# EasyEDA Pro project Kerbal Controller.eprj, board PCB1
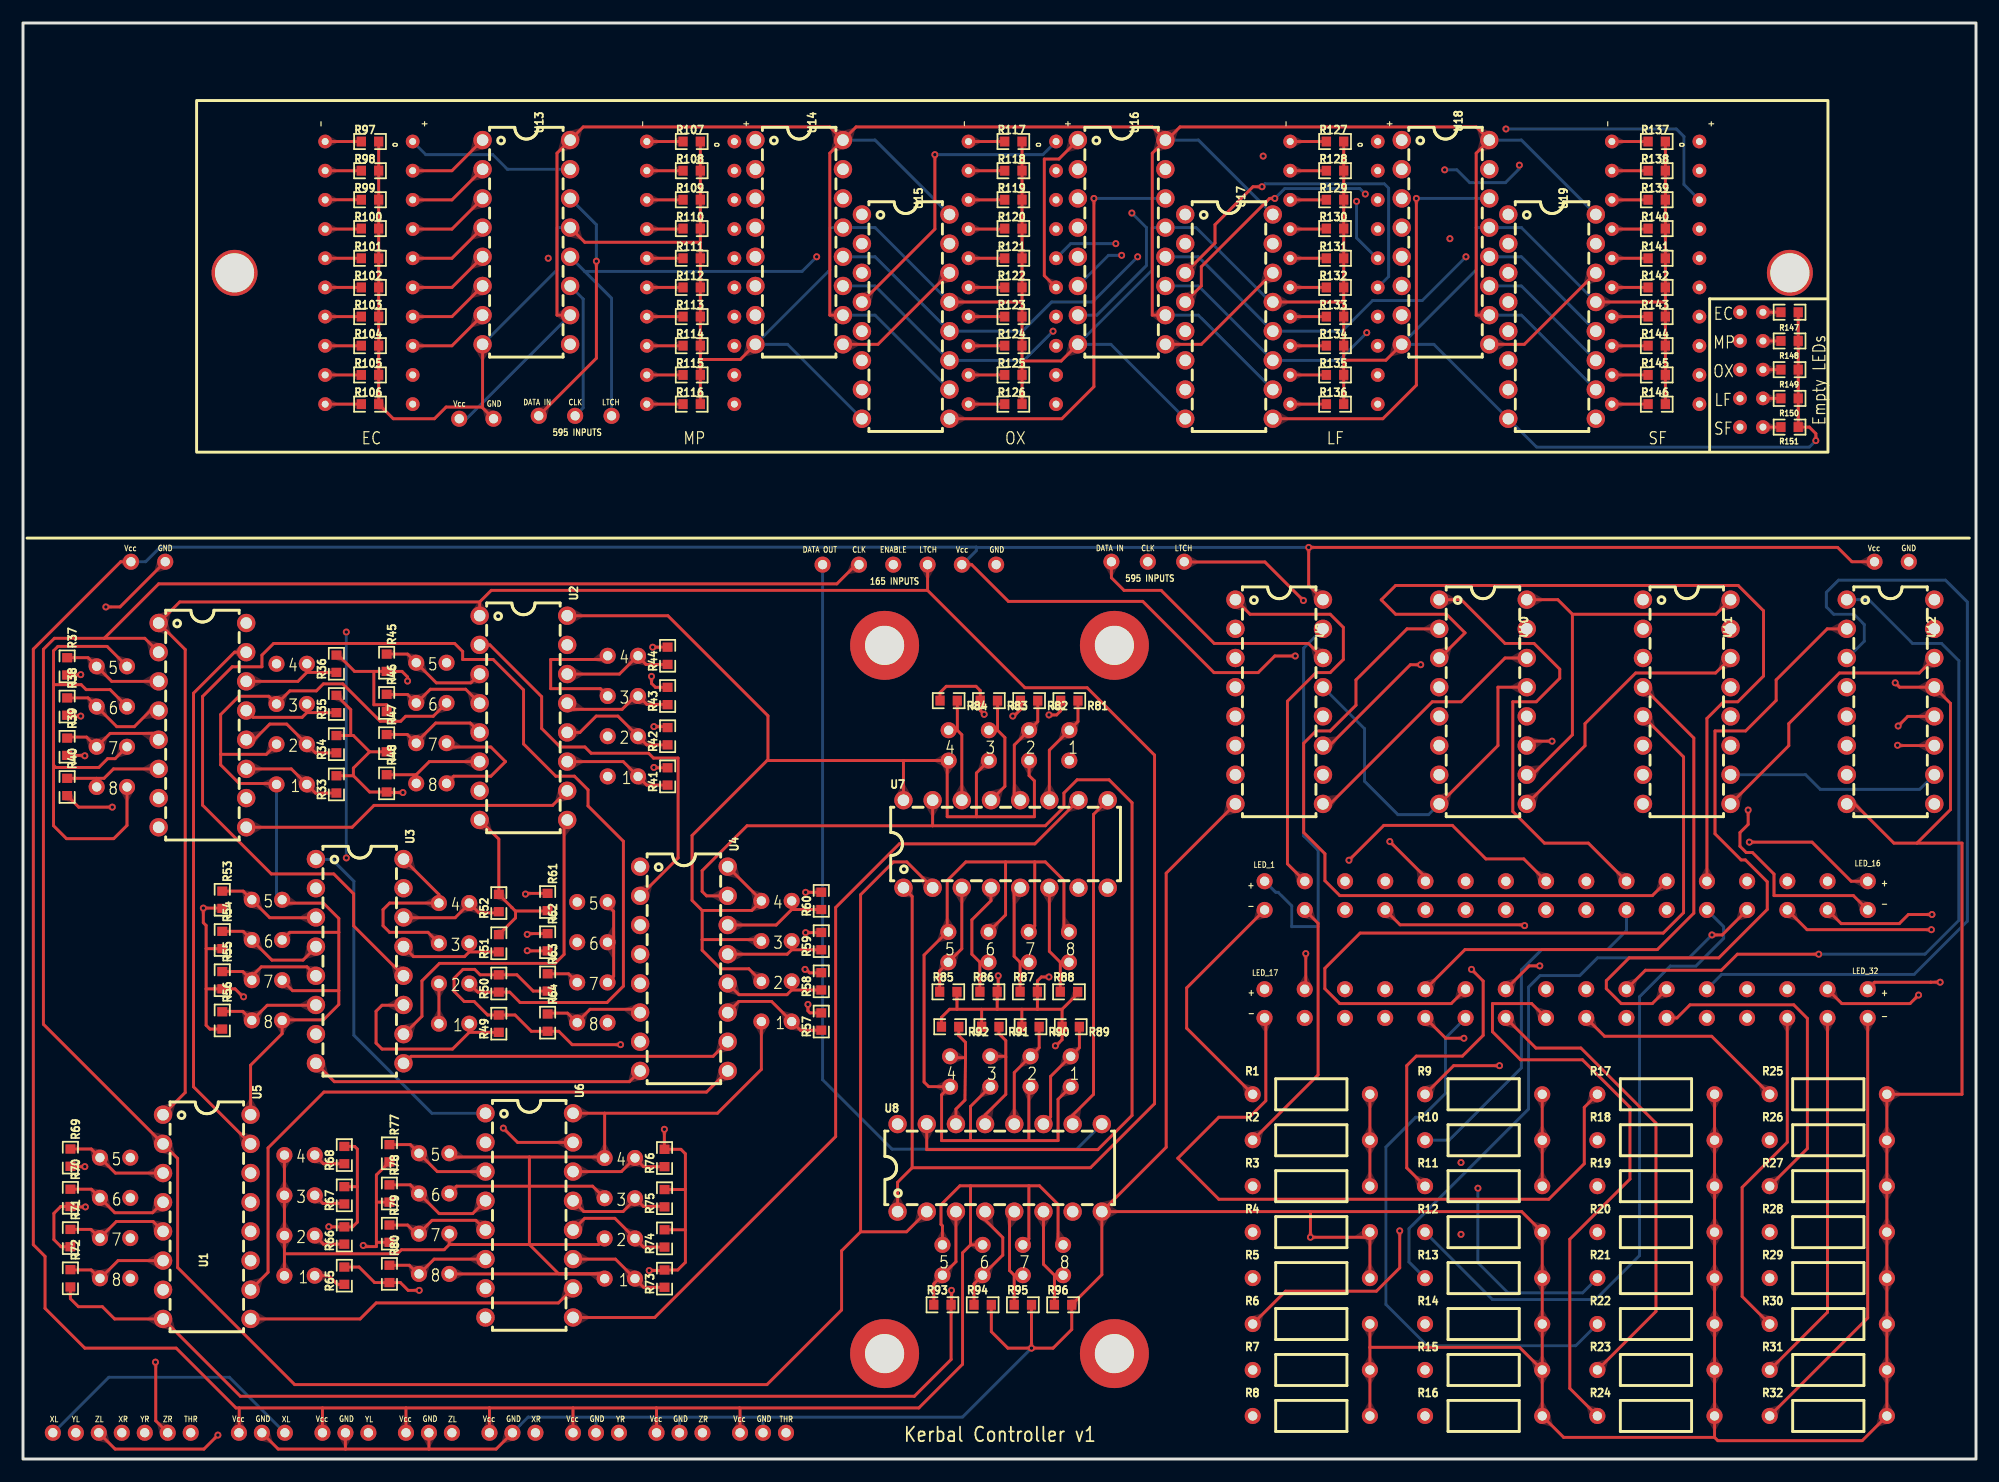
[diagram p1: board, top side]
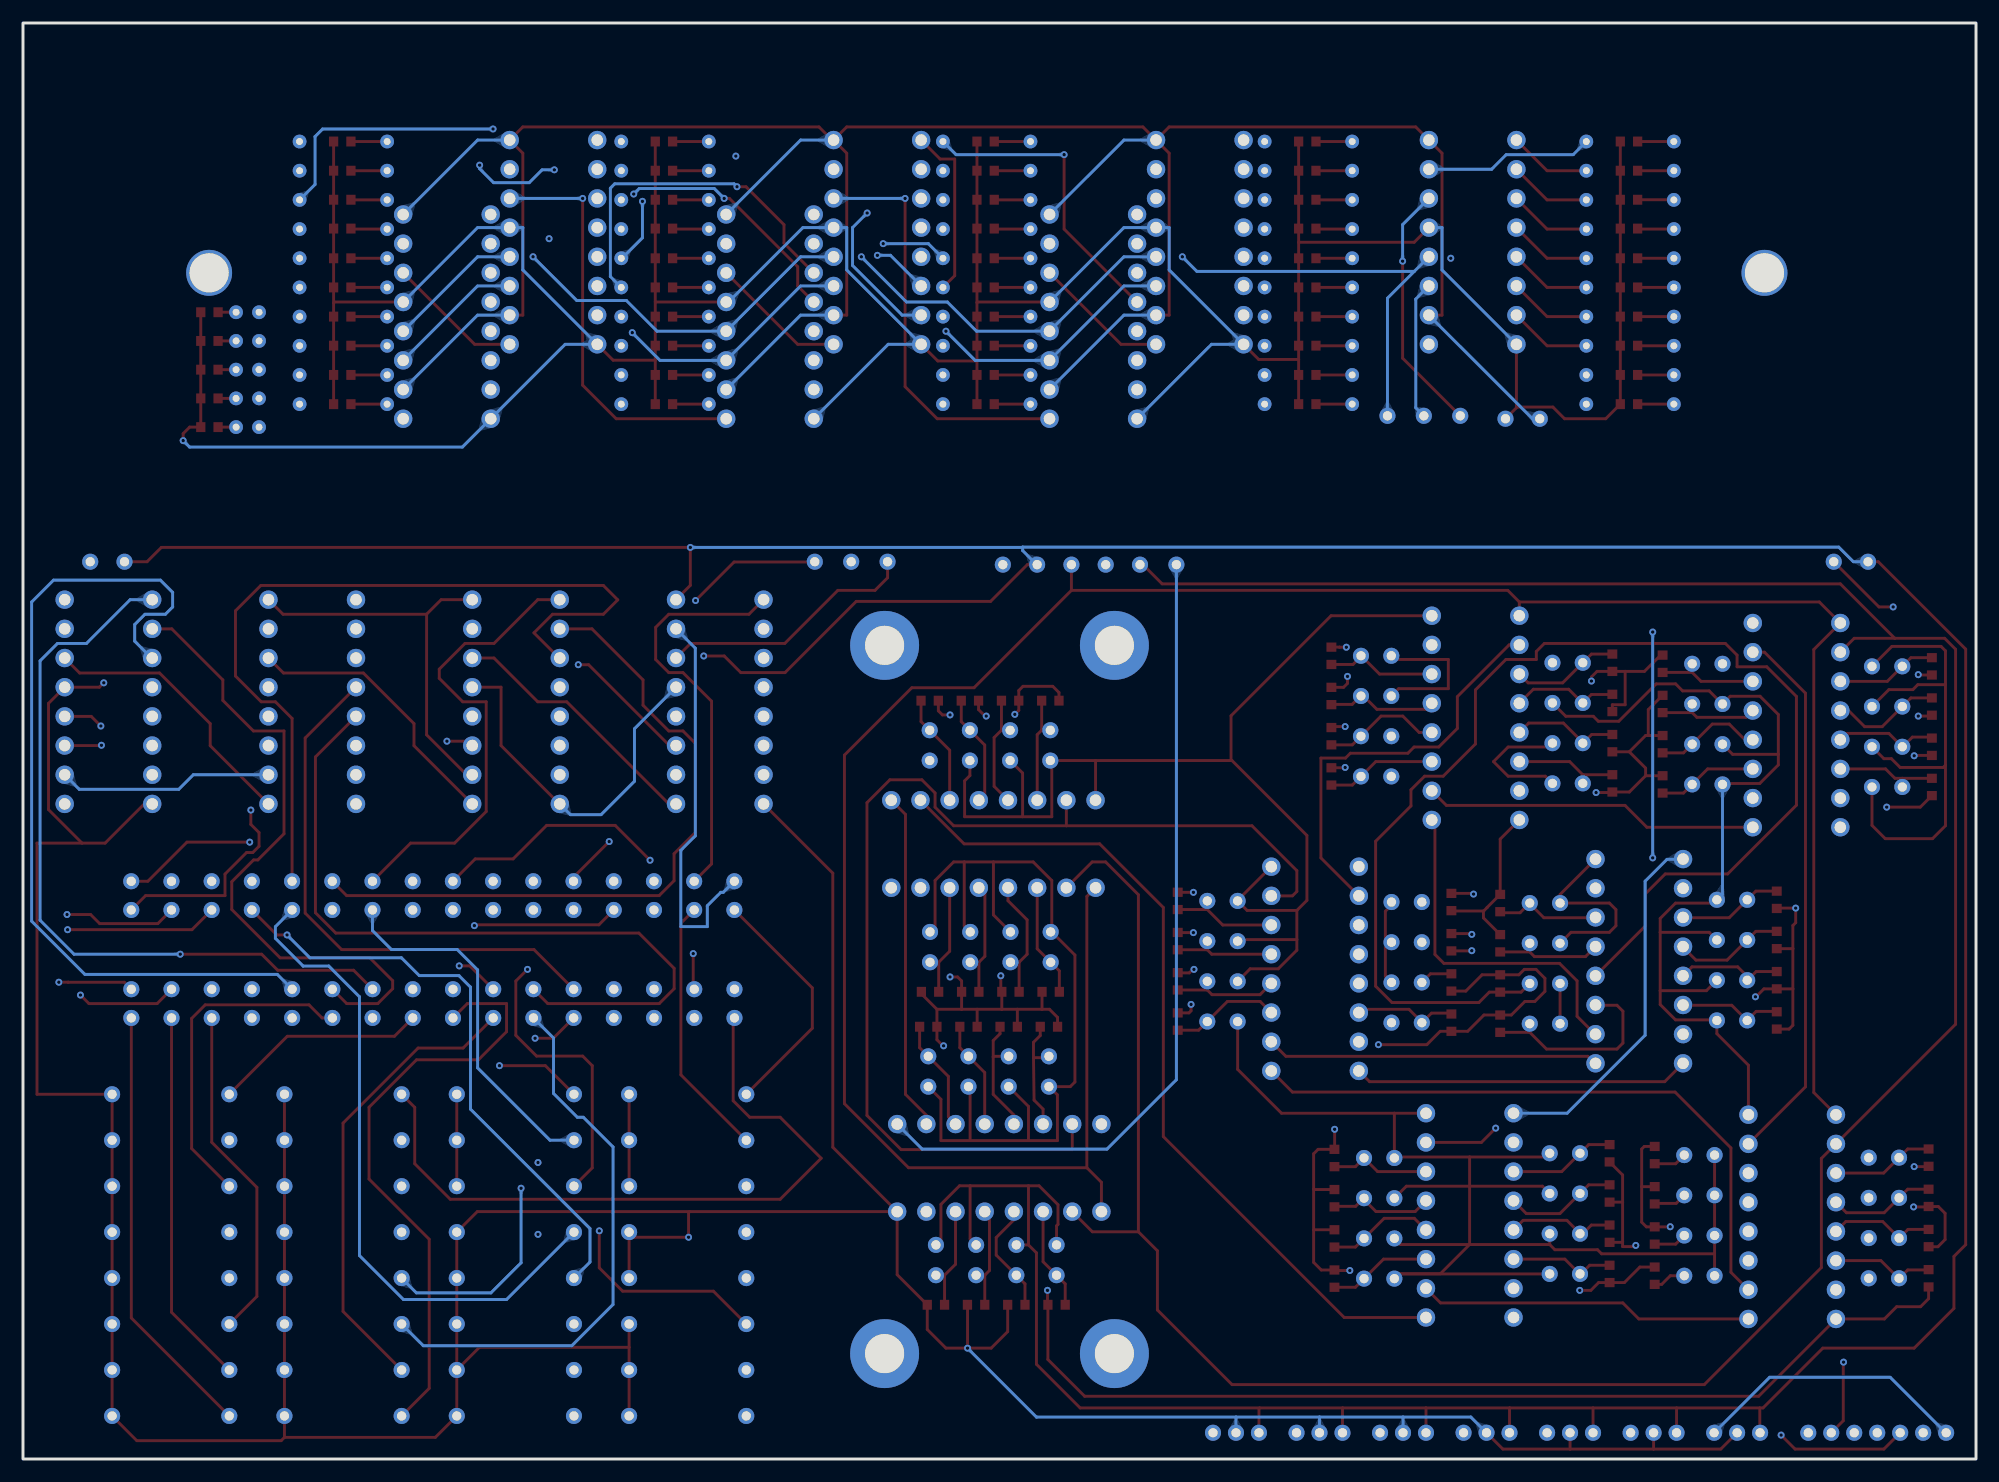
[diagram p2: board, bottom side, seen from below]

Outline 170 x 125 mm; copper layers: Top Layer, Inner1, Inner2, Bottom Layer. Coordinates in mm from the lower left corner of the outline.
Outline path: rectangle 0,125 170,0
Stack: Top Layer 0.035mm / Dielectric1 0.48mm PP er 4.5 / Inner1 0.035mm / Dielectric2 0.48mm FR4 er 4.5 / Inner2 0.035mm / Dielectric3 0.48mm PP er 4.5 / Bottom Layer 0.035mm

## Design rules (mm)
spacing safeClearance (default): track to track 0.152, other pairs 0.152 to 0.3
track width trackWidth (default): min 0.127, default 0.254, max 2.54
differential pair differentialPair (default): width min 0.127, default 0.254, max 2.54; gap min 0.152, default 0.152
via viaSize (default): diameter min 0.5, default 0.61, max 10; hole min 0.3, default 0.305, max 6

## Placement (name value [footprint] x y rotation side)
NOREF  -  [Pad_e11020]  48.24 37.98 270 top
NOREF#2  -  [Pad_e10925]  22.76 26.46 90 top
NOREF#3  -  [Pad_e7377]  82.3 101.98 0 top
NOREF#4  -  [Pad_e9050]  139.58 47.79 0 top
NOREF#5  -  [Pad_e7418]  145.92 112.14 0 top
NOREF#6  -  [Pad_e10947]  22.56 41.68 270 top
NOREF#7  -  [Pad_e10944]  84.05 43.24 0 top
NOREF#8  -  [Pad_e9063]  108.07 40.89 0 top
NOREF#9  -  [Pad_e7408]  110.3 94.36 0 top
NOREF#10  -  [Pad_e10998]  34.47 26.61 270 top
NOREF#11  -  [Pad_e94]  72.77 77.85 90 top
NOREF#12  -  [Pad_e9062]  160.58 47.79 0 top
NOREF#13  -  [Pad_e9038]  118.58 47.79 0 top
NOREF#14  -  [Pad_e149]  30.07 2.29 0 top
NOREF#15  -  [Pad_e9075]  129.07 40.89 0 top
NOREF#16  -  [Pad_e9032]  108.08 47.79 0 top
NOREF#17  -  [Pad_e7396]  117.92 112.14 0 top
NOREF#18  -  [Pad_e10990]  53.27 26.2 90 top
NOREF#19  -  [Pad_e10902]  25.4 15.96 90 top
NOREF#20  -  [Pad_e10938]  6.42 65.5 270 top
NOREF#21  -  [Pad_e10899]  36.21 37.89 90 top
NOREF#22  -  [Pad_e10963]  64.27 38.08 90 top
NOREF#23  -  [Pad_e174]  55.15 2.29 0 top
NOREF#24  -  [Pad_e100]  81.72 77.85 90 top
NOREF#25  -  [Pad_e187]  14.6 2.29 0 top
NOREF#26  -  [Pad_e7331]  54.3 94.36 0 top
NOREF#27  -  [Pad_e10958]  6.7 15.73 270 top
NOREF#28  -  [Pad_e7318]  33.92 99.44 0 top
NOREF#29  -  [Pad_e10975]  87.7 32.41 180 top
NOREF#30  -  [Pad_e8383]  75 9.18 0 top
NOREF#31  -  [Pad_e10914]  24.71 65.72 90 top
NOREF#32  -  [Pad_e151]  35.34 2.29 0 top
NOREF#33  -  [Pad_e10980]  66.91 45.08 90 top
NOREF#34  -  [Pad_e183]  6.6 2.29 0 top
NOREF#35  -  [Pad_e9048]  136.08 47.79 0 top
NOREF#36  -  [Pad_e7401]  110.3 104.52 0 top
NOREF#37  -  [Pad_e7414]  145.92 109.6 0 top
NOREF#38  -  [Pad_e9088]  150.07 38.39 0 top
NOREF#39  -  [Pad_e9039]  122.08 50.29 0 top
NOREF#40  -  [Pad_e7321]  26.3 94.36 0 top
NOREF#41  -  [Pad_e10995]  50.88 48.48 270 top
NOREF#42  -  [Pad_e11002]  34.23 65.81 270 top
NOREF#43  -  [Pad_e10936]  80.55 43.24 0 top
NOREF#44  -  [Pad_e9037]  118.58 50.29 0 top
NOREF#45  -  [Pad_e9089]  153.57 40.89 0 top
NOREF#46  -  [Pad_e10921]  22.07 69.22 90 top
NOREF#47  -  [Pad_e96]  75.76 77.85 90 top
NOREF#48  -  [Pad_e9509]  149.45 92.32 0 top
NOREF#49  -  [Pad_e10959]  91.05 45.88 0 top
NOREF#50  -  [Pad_e178]  64.42 2.29 0 top
NOREF#51  -  [Pad_e7381]  89.92 99.44 0 top
NOREF#52  -  [Pad_e9061]  160.58 50.29 0 top
NOREF#53  -  [Pad_e9042]  125.58 47.79 0 top
NOREF#54  -  [Pad_e7374]  89.92 112.14 0 top
NOREF#55  -  [Pad_e10924]  38.84 48.39 90 top
NOREF#56  -  [Pad_e7372]  89.92 107.06 0 top
NOREF#57  -  [Pad_e10993]  36.87 69.31 270 top
NOREF#58  -  [Pad_e7257]  33.92 107.06 0 top
NOREF#59  -  [Pad_e7393]  110.3 107.06 0 top
NOREF#60  -  [Pad_e7268]  61.92 109.6 0 top
NOREF#61  -  [Pad_e9043]  129.08 50.29 0 top
NOREF#62  -  [Pad_e9510]  151.45 92.32 0 top
NOREF#63  -  [Pad_e9055]  150.08 50.29 0 top
NOREF#64  -  [Pad_e7398]  117.92 114.68 0 top
NOREF#65  -  [Pad_e9081]  139.57 40.89 0 top
NOREF#66  -  [Pad_e7254]  26.3 109.6 0 top
NOREF#67  -  [Pad_e11011]  50.88 41.48 270 top
NOREF#68  -  [Pad_e11026]  90.53 16 0 top
NOREF#69  -  [Pad_e7322]  33.92 94.36 0 top
NOREF#70  -  [Pad_e98]  78.74 77.85 90 top
NOREF#71  -  [Pad_e154]  42.61 2.29 0 top
NOREF#72  -  [Pad_e10988]  66.91 48.58 90 top
NOREF#73  -  [Pad_e10932]  19.92 48.68 270 top
NOREF#74  -  [Pad_e9059]  157.08 50.29 0 top
NOREF#75  -  [Pad_e10918]  25.4 22.96 90 top
NOREF#76  -  [Pad_e9078]  132.57 38.39 0 top
NOREF#77  -  [Pad_e7416]  145.92 107.06 0 top
NOREF#78  -  [Pad_e181]  2.6 2.29 0 top
NOREF#79  -  [Pad_e10952]  87.55 43.24 0 top
NOREF#80  -  [Pad_e7333]  54.3 91.82 0 top
NOREF#81  -  [Pad_e9057]  153.58 50.29 0 top
NOREF#82  -  [Pad_e144]  18.8 2.29 0 top
NOREF#83  -  [Pad_e7269]  54.3 107.06 0 top
NOREF#84  -  [Pad_e10989]  50.63 26.2 90 top
NOREF#85  -  [Pad_e10971]  64.27 41.58 90 top
NOREF#86  -  [Pad_e10999]  80.03 18.64 0 top
NOREF#87  -  [Pad_e7313]  18.42 103.25 0 top
NOREF#88  -  [Pad_e9094]  160.57 38.39 0 top
NOREF#89  -  [Pad_e7402]  117.92 104.52 0 top
NOREF#90  -  [Pad_e7330]  61.92 96.9 0 top
NOREF#91  -  [Pad_e9064]  108.07 38.39 0 top
NOREF#92  -  [Pad_e7425]  145.92 99.44 0 top
NOREF#93  -  [Pad_e10911]  87.58 60.8 180 top
NOREF#94  -  [Pad_e7421]  138.3 101.98 0 top
NOREF#95  -  [Pad_e7378]  89.92 101.98 0 top
NOREF#96  -  [Pad_e7465]  44.89 90.81 0 top
NOREF#97  -  [Pad_e10926]  25.4 26.46 90 top
NOREF#98  -  [Pad_e102]  84.71 77.85 90 top
NOREF#99  -  [Pad_e9087]  150.07 40.89 0 top
NOREF#100  -  [Pad_e10961]  50.9 59.42 90 top
NOREF#101  -  [Pad_e11003]  50.88 44.98 270 top
NOREF#102  -  [Pad_e10978]  53.54 66.42 90 top
NOREF#103  -  [Pad_e10910]  25.4 19.46 90 top
NOREF#104  -  [Pad_e10905]  22.07 62.22 90 top
NOREF#105  -  [Pad_e10973]  50.63 19.2 90 top
NOREF#106  -  [Pad_e9507]  149.45 94.82 0 top
NOREF#107  -  [Pad_e9041]  125.58 50.29 0 top
NOREF#108  -  [Pad_e9068]  115.07 38.39 0 top
NOREF#109  -  [Pad_e7256]  26.3 107.06 0 top
NOREF#110  -  [Pad_e7251]  33.92 114.68 0 top
NOREF#111  -  [Pad_e9086]  146.57 38.39 0 top
NOREF#112  -  [Pad_e10908]  38.84 41.39 90 top
NOREF#113  -  [Pad_e10917]  22.76 22.96 90 top
NOREF#114  -  [Pad_e7270]  61.92 107.06 0 top
NOREF#115  -  [Pad_e9049]  139.58 50.29 0 top
NOREF#116  -  [Pad_e7391]  110.3 109.6 0 top
NOREF#117  -  [Pad_e16678]  9.4 78.11 90 top
NOREF#118  -  [Pad_e10949]  9.34 19.23 270 top
NOREF#119  -  [Pad_e176]  59.15 2.29 0 top
NOREF#120  -  [Pad_e10984]  84.2 35.05 180 top
NOREF#121  -  [Pad_e184]  8.6 2.29 0 top
NOREF#122  -  [Pad_e10977]  50.9 66.42 90 top
NOREF#123  -  [Pad_e7380]  89.92 104.52 0 top
NOREF#124  -  [Pad_e157]  49.88 2.29 0 top
NOREF#125  -  [Pad_e10962]  53.54 59.42 90 top
NOREF#126  -  [Pad_e9074]  125.57 38.39 0 top
NOREF#127  -  [Pad_e11007]  83.53 18.64 0 top
NOREF#128  -  [Pad_e16676]  161.16 78.11 90 top
NOREF#129  -  [Pad_e10983]  84.2 32.41 180 top
NOREF#130  -  [Pad_e9071]  122.07 40.89 0 top
NOREF#131  -  [Pad_e9085]  146.57 40.89 0 top
NOREF#132  -  [Pad_e9504]  151.45 99.82 0 top
NOREF#133  -  [Pad_e7255]  33.92 109.6 0 top
NOREF#134  -  [Pad_e11021]  37.11 16.11 270 top
NOREF#135  -  [Pad_e10964]  66.91 38.08 90 top
NOREF#136  -  [Pad_e10965]  50.63 15.7 90 top
NOREF#137  -  [Pad_e9092]  157.07 38.39 0 top
NOREF#138  -  [Pad_e10954]  6.42 58.5 270 top
NOREF#139  -  [Pad_e9054]  146.58 47.79 0 top
NOREF#140  -  [Pad_e9056]  150.08 47.79 0 top
NOREF#141  -  [Pad_e10900]  38.84 37.89 90 top
NOREF#142  -  [Pad_e7406]  110.3 96.9 0 top
NOREF#143  -  [Pad_e10903]  91.08 60.8 180 top
NOREF#144  -  [Pad_e11005]  37.11 23.11 270 top
NOREF#145  -  [Pad_e7196]  94.74 78.11 0 top
NOREF#146  -  [Pad_e7258]  26.3 104.52 0 top
NOREF#147  -  [Pad_e7264]  61.92 114.68 0 top
NOREF#148  -  [Pad_e11014]  34.47 19.61 270 top
NOREF#149  -  [Pad_e10970]  53.54 62.92 90 top
NOREF#150  -  [Pad_e7197]  97.91 78.11 0 top
NOREF#151  -  [Pad_e16675]  164.15 78.11 90 top
NOREF#152  -  [Pad_e10986]  53.54 69.92 90 top
NOREF#153  -  [Pad_e10940]  19.92 45.18 270 top
NOREF#154  -  [Pad_e9036]  115.08 47.79 0 top
NOREF#155  -  [Pad_e9084]  143.07 38.39 0 top
NOREF#156  -  [Pad_e9511]  149.45 89.82 0 top
NOREF#157  -  [Pad_e7407]  117.92 96.9 0 top
NOREF#158  -  [Pad_e11013]  37.11 19.61 270 top
NOREF#159  -  [Pad_e179]  66.42 2.29 0 top
NOREF#160  -  [Pad_e7385]  89.92 96.9 0 top
NOREF#161  -  [Pad_e9067]  115.07 40.89 0 top
NOREF#162  -  [Pad_e9505]  149.45 97.32 0 top
NOREF#163  -  [Pad_e10992]  80.7 35.05 180 top
NOREF#164  -  [Pad_e7387]  89.92 94.36 0 top
NOREF#165  -  [Pad_e10950]  6.7 19.23 270 top
NOREF#166  -  [Pad_e7420]  145.92 114.68 0 top
NOREF#167  -  [Pad_e9091]  157.07 40.89 0 top
NOREF#168  -  [Pad_e7327]  54.3 99.44 0 top
NOREF#169  -  [Pad_e10997]  37.11 26.61 270 top
NOREF#170  -  [Pad_e10991]  80.7 32.41 180 top
NOREF#171  -  [Pad_e7267]  54.3 109.6 0 top
NOREF#172  -  [Pad_e10974]  53.27 19.2 90 top
NOREF#173  -  [Pad_e7326]  61.92 101.98 0 top
NOREF#174  -  [Pad_e10920]  84.08 63.44 180 top
NOREF#175  -  [Pad_e11016]  87.03 16 0 top
NOREF#176  -  [Pad_e145]  20.8 2.29 0 top
NOREF#177  -  [Pad_e10953]  9.06 58.5 270 top
NOREF#178  -  [Pad_e10943]  84.05 45.88 0 top
NOREF#179  -  [Pad_e9090]  153.57 38.39 0 top
NOREF#180  -  [Pad_e10960]  91.05 43.24 0 top
NOREF#181  -  [Pad_e7329]  54.3 96.9 0 top
NOREF#182  -  [Pad_e7373]  82.3 112.14 0 top
NOREF#183  -  [Pad_e10933]  9.34 26.23 270 top
NOREF#184  -  [Pad_e9077]  132.57 40.89 0 top
NOREF#185  -  [Pad_e7426]  138.3 91.82 0 top
NOREF#186  -  [Pad_e10968]  91.2 35.05 180 top
NOREF#187  -  [Pad_e7417]  138.3 112.14 0 top
NOREF#188  -  [Pad_e10951]  87.55 45.88 0 top
NOREF#189  -  [Pad_e8382]  95 70.83 0 top
NOREF#190  -  [Pad_e10909]  22.76 19.46 90 top
NOREF#191  -  [Pad_e11010]  34.23 62.31 270 top
NOREF#192  -  [Pad_e152]  37.34 2.29 0 top
NOREF#193  -  [Pad_e10937]  9.06 65.5 270 top
NOREF#194  -  [Pad_e10969]  50.9 62.92 90 top
NOREF#195  -  [Pad_e10907]  36.21 41.39 90 top
NOREF#196  -  [Pad_e7319]  26.3 96.9 0 top
NOREF#197  -  [Pad_e10929]  9.06 69 270 top
NOREF#198  -  [Pad_e10930]  6.42 69 270 top
NOREF#199  -  [Pad_e7328]  61.92 99.44 0 top
NOREF#200  -  [Pad_e10931]  22.56 48.68 270 top
NOREF#201  -  [Pad_e10912]  87.58 63.44 180 top
NOREF#202  -  [Pad_e7314]  153.8 103.25 0 top
NOREF#203  -  [Pad_e7415]  138.3 107.06 0 top
NOREF#204  -  [Pad_e9503]  149.45 99.82 0 top
NOREF#205  -  [Pad_e7409]  117.92 94.36 0 top
NOREF#206  -  [Pad_e9053]  146.58 50.29 0 top
NOREF#207  -  [Pad_e11015]  87.03 18.64 0 top
NOREF#208  -  [Pad_e7397]  110.3 114.68 0 top
NOREF#209  -  [Pad_e9069]  118.57 40.89 0 top
NOREF#210  -  [Pad_e7424]  145.92 104.52 0 top
NOREF#211  -  [Pad_e9045]  132.58 50.29 0 top
NOREF#212  -  [Pad_e10946]  6.42 62 270 top
NOREF#213  -  [Pad_e7423]  138.3 104.52 0 top
NOREF#214  -  [Pad_e10981]  50.63 22.7 90 top
NOREF#215  -  [Pad_e9512]  151.45 89.82 0 top
NOREF#216  -  [Pad_e147]  26.07 2.29 0 top
NOREF#217  -  [Pad_e9066]  111.57 38.39 0 top
NOREF#218  -  [Pad_e175]  57.15 2.29 0 top
NOREF#219  -  [Pad_e11025]  90.53 18.64 0 top
NOREF#220  -  [Pad_e7413]  138.3 109.6 0 top
NOREF#221  -  [Pad_e56]  69.6 77.85 0 top
NOREF#222  -  [Pad_e177]  62.42 2.29 0 top
NOREF#223  -  [Pad_e7324]  33.92 91.82 0 top
NOREF#224  -  [Pad_e9040]  122.08 47.79 0 top
NOREF#225  -  [Pad_e7332]  61.92 94.36 0 top
NOREF#226  -  [Pad_e158]  51.88 2.29 0 top
NOREF#227  -  [Pad_e7419]  138.3 114.68 0 top
NOREF#228  -  [Pad_e10913]  22.07 65.72 90 top
NOREF#229  -  [Pad_e11019]  50.88 37.98 270 top
NOREF#230  -  [Pad_e150]  33.34 2.29 0 top
NOREF#231  -  [Pad_e155]  44.61 2.29 0 top
NOREF#232  -  [Pad_e8380]  75 70.83 0 top
NOREF#233  -  [Pad_e9072]  122.07 38.39 0 top
NOREF#234  -  [Pad_e9060]  157.08 47.79 0 top
NOREF#235  -  [Pad_e11009]  36.87 62.31 270 top
NOREF#236  -  [Pad_e9035]  115.08 50.29 0 top
NOREF#237  -  [Pad_e7263]  54.3 114.68 0 top
NOREF#238  -  [Pad_e7469]  37.97 90.55 90 top
NOREF#239  -  [Pad_e10904]  91.08 63.44 180 top
NOREF#240  -  [Pad_e7265]  54.3 112.14 0 top
NOREF#241  -  [Pad_e11022]  34.47 16.11 270 top
NOREF#242  -  [Pad_e9070]  118.57 38.39 0 top
NOREF#243  -  [Pad_e10934]  6.7 26.23 270 top
NOREF#244  -  [Pad_e186]  12.6 2.29 0 top
NOREF#245  -  [Pad_e10935]  80.55 45.88 0 top
NOREF#246  -  [Pad_e11008]  83.53 16 0 top
NOREF#247  -  [Pad_e7429]  145.92 96.9 0 top
NOREF#248  -  [Pad_e7463]  51.23 90.81 0 top
NOREF#249  -  [Pad_e7334]  61.92 91.82 0 top
NOREF#250  -  [Pad_e9033]  111.58 50.29 0 top
NOREF#251  -  [Pad_e7432]  145.92 91.82 0 top
NOREF#252  -  [Pad_e7388]  89.92 91.82 0 top
NOREF#253  -  [Pad_e7370]  89.92 109.6 0 top
NOREF#254  -  [Pad_e9034]  111.58 47.79 0 top
NOREF#255  -  [Pad_e7261]  33.92 104.52 0 top
NOREF#256  -  [Pad_e10957]  9.34 15.73 270 top
NOREF#257  -  [Pad_e10956]  19.92 38.18 270 top
NOREF#258  -  [Pad_e7430]  138.3 94.36 0 top
NOREF#259  -  [Pad_e16677]  12.38 78.11 90 top
NOREF#260  -  [Pad_e10927]  80.58 60.8 180 top
NOREF#261  -  [Pad_e10955]  22.56 38.18 270 top
NOREF#262  -  [Pad_e10942]  6.7 22.73 270 top
NOREF#263  -  [Pad_e7383]  82.3 99.44 0 top
NOREF#264  -  [Pad_e7399]  110.3 101.98 0 top
NOREF#265  -  [Pad_e7272]  61.92 104.52 0 top
NOREF#266  -  [Pad_e11018]  34.23 58.81 270 top
NOREF#267  -  [Pad_e9083]  143.07 40.89 0 top
NOREF#268  -  [Pad_e10976]  87.7 35.05 180 top
NOREF#269  -  [Pad_e11004]  48.24 44.98 270 top
NOREF#270  -  [Pad_e7395]  110.3 112.14 0 top
NOREF#271  -  [Pad_e10967]  91.2 32.41 180 top
NOREF#272  -  [Pad_e10898]  24.71 58.72 90 top
NOREF#273  -  [Pad_e7384]  82.3 96.9 0 top
NOREF#274  -  [Pad_e7369]  82.3 109.6 0 top
NOREF#275  -  [Pad_e7315]  26.3 101.98 0 top
NOREF#276  -  [Pad_e9506]  151.45 97.32 0 top
NOREF#277  -  [Pad_e7404]  110.3 91.82 0 top
NOREF#278  -  [Pad_e7410]  117.92 91.82 0 top
NOREF#279  -  [Pad_e10916]  38.84 44.89 90 top
NOREF#280  -  [Pad_e10915]  36.21 44.89 90 top
NOREF#281  -  [Pad_e10972]  66.91 41.58 90 top
NOREF#282  -  [Pad_e7375]  82.3 114.68 0 top
NOREF#283  -  [Pad_e7376]  89.92 114.68 0 top
NOREF#284  -  [Pad_e10987]  64.27 48.58 90 top
NOREF#285  -  [Pad_e10979]  64.27 45.08 90 top
NOREF#286  -  [Pad_e7271]  54.3 104.52 0 top
NOREF#287  -  [Pad_e146]  22.8 2.29 0 top
NOREF#288  -  [Pad_e182]  4.6 2.29 0 top
NOREF#289  -  [Pad_e10982]  53.27 22.7 90 top
NOREF#290  -  [Pad_e9076]  129.07 38.39 0 top
NOREF#291  -  [Pad_e10939]  22.56 45.18 270 top
NOREF#292  -  [Pad_e11006]  34.47 23.11 270 top
NOREF#293  -  [Pad_e7382]  82.3 91.82 0 top
NOREF#294  -  [Pad_e9073]  125.57 40.89 0 top
NOREF#295  -  [Pad_e9046]  132.58 47.79 0 top
NOREF#296  -  [Pad_e153]  40.61 2.29 0 top
NOREF#297  -  [Pad_e7320]  33.92 96.9 0 top
NOREF#298  -  [Pad_e9058]  153.58 47.79 0 top
NOREF#299  -  [Pad_e9082]  139.57 38.39 0 top
NOREF#300  -  [Pad_e10994]  34.23 69.31 270 top
NOREF#301  -  [Pad_e7392]  117.92 109.6 0 top
NOREF#302  -  [Pad_e9093]  160.57 40.89 0 top
NOREF#303  -  [Pad_e7394]  117.92 107.06 0 top
NOREF#304  -  [Pad_e11001]  36.87 65.81 270 top
NOREF#305  -  [Pad_e10922]  24.71 69.22 90 top
NOREF#306  -  [Pad_e9044]  129.08 47.79 0 top
NOREF#307  -  [Pad_e7371]  82.3 107.06 0 top
NOREF#308  -  [Pad_e7323]  26.3 91.82 0 top
NOREF#309  -  [Pad_e9080]  136.07 38.39 0 top
NOREF#310  -  [Pad_e7198]  101.08 78.11 0 top
NOREF#311  -  [Pad_e9047]  136.08 50.29 0 top
NOREF#312  -  [Pad_e7427]  138.3 99.44 0 top
NOREF#313  -  [Pad_e7253]  33.92 112.14 0 top
NOREF#314  -  [Pad_e7386]  82.3 94.36 0 top
NOREF#315  -  [Pad_e9031]  108.08 50.29 0 top
NOREF#316  -  [Pad_e10919]  84.08 60.8 180 top
NOREF#317  -  [Pad_e7422]  145.92 101.98 0 top
NOREF#318  -  [Pad_e7325]  54.3 101.98 0 top
NOREF#319  -  [Pad_e10985]  50.9 69.92 90 top
NOREF#320  -  [Pad_e7379]  82.3 104.52 0 top
NOREF#321  -  [Pad_e7428]  138.3 96.9 0 top
NOREF#322  -  [Pad_e8384]  95 9.18 0 top
NOREF#323  -  [Pad_e7317]  26.3 99.44 0 top
NOREF#324  -  [Pad_e10923]  36.21 48.39 90 top
NOREF#325  -  [Pad_e11012]  48.24 41.48 270 top
NOREF#326  -  [Pad_e10945]  9.06 62 270 top
NOREF#327  -  [Pad_e9065]  111.57 40.89 0 top
NOREF#328  -  [Pad_e10928]  80.58 63.44 180 top
NOREF#329  -  [Pad_e9051]  143.08 50.29 0 top
NOREF#330  -  [Pad_e7464]  48.06 90.81 0 top
NOREF#331  -  [Pad_e10966]  53.27 15.7 90 top
NOREF#332  -  [Pad_e7466]  40.96 90.55 90 top
NOREF#333  -  [Pad_e9079]  136.07 40.89 0 top
NOREF#334  -  [Pad_e148]  28.07 2.29 0 top
NOREF#335  -  [Pad_e7316]  33.92 101.98 0 top
NOREF#336  -  [Pad_e10941]  9.34 22.73 270 top
NOREF#337  -  [Pad_e7250]  26.3 114.68 0 top
NOREF#338  -  [Pad_e7431]  145.92 94.36 0 top
NOREF#339  -  [Pad_e185]  10.6 2.29 0 top
NOREF#340  -  [Pad_e9508]  151.45 94.82 0 top
NOREF#341  -  [Pad_e7266]  61.92 112.14 0 top
NOREF#342  -  [Pad_e10906]  24.71 62.22 90 top
NOREF#343  -  [Pad_e7400]  117.92 101.98 0 top
NOREF#344  -  [Pad_e7252]  26.3 112.14 0 top
NOREF#345  -  [Pad_e11017]  36.87 58.81 270 top
NOREF#346  -  [Pad_e7403]  117.92 99.44 0 top
NOREF#347  -  [Pad_e10901]  22.76 15.96 90 top
NOREF#348  -  [Pad_e10897]  22.07 58.72 90 top
NOREF#349  -  [Pad_e11000]  80.03 16 0 top
NOREF#350  -  [Pad_e9052]  143.08 47.79 0 top
NOREF#351  -  [Pad_e10996]  48.24 48.48 270 top
NOREF#352  -  [Pad_e156]  47.88 2.29 0 top
NOREF#353  -  [Pad_e7405]  110.3 99.44 0 top
NOREF#354  -  [Pad_e10948]  19.92 41.68 270 top
R1  220kΩ  [RES-TH_BD2.7-L6.2-P10.20-D0.4]  112.14 31.75 0 top
R2  220kΩ  [RES-TH_BD2.7-L6.2-P10.20-D0.4]  112.14 27.75 0 top
R3  220kΩ  [RES-TH_BD2.7-L6.2-P10.20-D0.4]  112.14 23.75 0 top
R4  220kΩ  [RES-TH_BD2.7-L6.2-P10.20-D0.4]  112.14 19.75 0 top
R5  220kΩ  [RES-TH_BD2.7-L6.2-P10.20-D0.4]  112.14 15.75 0 top
R6  220kΩ  [RES-TH_BD2.7-L6.2-P10.20-D0.4]  112.14 11.75 0 top
R7  220kΩ  [RES-TH_BD2.7-L6.2-P10.20-D0.4]  112.14 7.75 0 top
R8  220kΩ  [RES-TH_BD2.7-L6.2-P10.20-D0.4]  112.14 3.75 0 top
R9  220kΩ  [RES-TH_BD2.7-L6.2-P10.20-D0.4]  127.14 31.75 0 top
R10  220kΩ  [RES-TH_BD2.7-L6.2-P10.20-D0.4]  127.14 27.75 0 top
R11  220kΩ  [RES-TH_BD2.7-L6.2-P10.20-D0.4]  127.14 23.75 0 top
R12  220kΩ  [RES-TH_BD2.7-L6.2-P10.20-D0.4]  127.14 19.75 0 top
R13  220kΩ  [RES-TH_BD2.7-L6.2-P10.20-D0.4]  127.14 15.75 0 top
R14  220kΩ  [RES-TH_BD2.7-L6.2-P10.20-D0.4]  127.14 11.75 0 top
R15  220kΩ  [RES-TH_BD2.7-L6.2-P10.20-D0.4]  127.14 7.75 0 top
R16  220kΩ  [RES-TH_BD2.7-L6.2-P10.20-D0.4]  127.14 3.75 0 top
R17  220kΩ  [RES-TH_BD2.7-L6.2-P10.20-D0.4]  142.14 31.75 0 top
R18  220kΩ  [RES-TH_BD2.7-L6.2-P10.20-D0.4]  142.14 27.75 0 top
R19  220kΩ  [RES-TH_BD2.7-L6.2-P10.20-D0.4]  142.14 23.75 0 top
R20  220kΩ  [RES-TH_BD2.7-L6.2-P10.20-D0.4]  142.14 19.75 0 top
R21  220kΩ  [RES-TH_BD2.7-L6.2-P10.20-D0.4]  142.14 15.75 0 top
R22  220kΩ  [RES-TH_BD2.7-L6.2-P10.20-D0.4]  142.14 11.75 0 top
R23  220kΩ  [RES-TH_BD2.7-L6.2-P10.20-D0.4]  142.14 7.75 0 top
R24  220kΩ  [RES-TH_BD2.7-L6.2-P10.20-D0.4]  142.14 3.75 0 top
R25  220kΩ  [RES-TH_BD2.7-L6.2-P10.20-D0.4]  157.14 31.75 0 top
R26  220kΩ  [RES-TH_BD2.7-L6.2-P10.20-D0.4]  157.14 27.75 0 top
R27  220kΩ  [RES-TH_BD2.7-L6.2-P10.20-D0.4]  157.14 23.75 0 top
R28  220kΩ  [RES-TH_BD2.7-L6.2-P10.20-D0.4]  157.14 19.75 0 top
R29  220kΩ  [RES-TH_BD2.7-L6.2-P10.20-D0.4]  157.14 15.75 0 top
R30  220kΩ  [RES-TH_BD2.7-L6.2-P10.20-D0.4]  157.14 11.75 0 top
R31  220kΩ  [RES-TH_BD2.7-L6.2-P10.20-D0.4]  157.14 7.75 0 top
R32  220kΩ  [RES-TH_BD2.7-L6.2-P10.20-D0.4]  157.14 3.75 0 top
R33  10kΩ  [R0603]  27.28 58.72 90 top
R34  10kΩ  [R0603]  27.28 62.22 90 top
R35  10kΩ  [R0603]  27.28 65.72 90 top
R36  10kΩ  [R0603]  27.28 69.22 90 top
R37  10kΩ  [R0603]  3.84 69 270 top
R38  10kΩ  [R0603]  3.84 65.5 270 top
R39  10kΩ  [R0603]  3.84 62 270 top
R40  10kΩ  [R0603]  3.84 58.5 270 top
R41  10kΩ  [R0603]  56.11 59.42 90 top
R42  10kΩ  [R0603]  56.11 62.92 90 top
R43  10kΩ  [R0603]  56.11 66.42 90 top
R44  10kΩ  [R0603]  56.11 69.92 90 top
R45  10kΩ  [R0603]  31.66 69.31 270 top
R46  10kΩ  [R0603]  31.66 65.81 270 top
R47  10kΩ  [R0603]  31.66 62.31 270 top
R48  10kΩ  [R0603]  31.66 58.81 270 top
R49  10kΩ  [R0603]  41.42 37.89 90 top
R50  10kΩ  [R0603]  41.42 41.39 90 top
R51  10kΩ  [R0603]  41.42 44.89 90 top
R52  10kΩ  [R0603]  41.42 48.39 90 top
R53  10kΩ  [R0603]  17.34 48.68 270 top
R54  10kΩ  [R0603]  17.34 45.18 270 top
R55  10kΩ  [R0603]  17.34 41.68 270 top
R56  10kΩ  [R0603]  17.34 38.18 270 top
R57  10kΩ  [R0603]  69.49 38.08 90 top
R58  10kΩ  [R0603]  69.49 41.58 90 top
R59  10kΩ  [R0603]  69.49 45.08 90 top
R60  10kΩ  [R0603]  69.49 48.58 90 top
R61  10kΩ  [R0603]  45.67 48.48 270 top
R62  10kΩ  [R0603]  45.67 44.98 270 top
R63  10kΩ  [R0603]  45.67 41.48 270 top
R64  10kΩ  [R0603]  45.67 37.98 270 top
R65  10kΩ  [R0603]  27.97 15.96 90 top
R66  10kΩ  [R0603]  27.97 19.46 90 top
R67  10kΩ  [R0603]  27.97 22.96 90 top
R68  10kΩ  [R0603]  27.97 26.46 90 top
R69  10kΩ  [R0603]  4.13 26.23 270 top
R70  10kΩ  [R0603]  4.13 22.73 270 top
R71  10kΩ  [R0603]  4.13 19.23 270 top
R72  10kΩ  [R0603]  4.13 15.73 270 top
R73  10kΩ  [R0603]  55.84 15.7 90 top
R74  10kΩ  [R0603]  55.84 19.2 90 top
R75  10kΩ  [R0603]  55.84 22.7 90 top
R76  10kΩ  [R0603]  55.84 26.2 90 top
R77  10kΩ  [R0603]  31.9 26.61 270 top
R78  10kΩ  [R0603]  31.9 23.11 270 top
R79  10kΩ  [R0603]  31.9 19.61 270 top
R80  10kΩ  [R0603]  31.9 16.11 270 top
R81  10kΩ  [R0603]  91.08 66.01 180 top
R82  10kΩ  [R0603]  87.58 66.01 180 top
R83  10kΩ  [R0603]  84.08 66.01 180 top
R84  10kΩ  [R0603]  80.58 66.01 180 top
R85  10kΩ  [R0603]  80.55 40.67 0 top
R86  10kΩ  [R0603]  84.05 40.67 0 top
R87  10kΩ  [R0603]  87.55 40.67 0 top
R88  10kΩ  [R0603]  91.05 40.67 0 top
R89  10kΩ  [R0603]  91.2 37.63 180 top
R90  10kΩ  [R0603]  87.7 37.63 180 top
R91  10kΩ  [R0603]  84.2 37.63 180 top
R92  10kΩ  [R0603]  80.7 37.63 180 top
R93  10kΩ  [R0603]  80.03 13.43 0 top
R94  10kΩ  [R0603]  83.53 13.43 0 top
R95  10kΩ  [R0603]  87.03 13.43 0 top
R96  10kΩ  [R0603]  90.53 13.43 0 top
R97  220Ω  [R0603]  30.21 114.68 0 top
R98  470Ω  [R0603]  30.21 112.14 0 top
R99  470Ω  [R0603]  30.21 109.61 0 top
R100  470Ω  [R0603]  30.21 107.1 0 top
R101  470Ω  [R0603]  30.21 104.52 0 top
R102  150Ω  [R0603]  30.21 101.98 0 top
R103  150Ω  [R0603]  30.21 99.44 0 top
R104  150Ω  [R0603]  30.21 96.91 0 top
R105  220Ω  [R0603]  30.21 94.36 0 top
R106  220Ω  [R0603]  30.21 91.82 0 top
R107  220Ω  [R0603]  58.21 114.68 0 top
R108  470Ω  [R0603]  58.21 112.14 0 top
R109  470Ω  [R0603]  58.21 109.61 0 top
R110  470Ω  [R0603]  58.21 107.1 0 top
R111  470Ω  [R0603]  58.21 104.52 0 top
R112  150Ω  [R0603]  58.21 101.98 0 top
R113  150Ω  [R0603]  58.21 99.44 0 top
R114  150Ω  [R0603]  58.21 96.91 0 top
R115  220Ω  [R0603]  58.21 94.36 0 top
R116  220Ω  [R0603]  58.21 91.82 0 top
R117  220Ω  [R0603]  86.21 114.68 0 top
R118  470Ω  [R0603]  86.21 112.14 0 top
R119  470Ω  [R0603]  86.21 109.61 0 top
R120  470Ω  [R0603]  86.21 107.1 0 top
R121  470Ω  [R0603]  86.21 104.52 0 top
R122  150Ω  [R0603]  86.21 101.98 0 top
R123  150Ω  [R0603]  86.21 99.44 0 top
R124  150Ω  [R0603]  86.21 96.91 0 top
R125  220Ω  [R0603]  86.21 94.36 0 top
R126  220Ω  [R0603]  86.21 91.82 0 top
R127  220Ω  [R0603]  114.21 114.68 0 top
R128  470Ω  [R0603]  114.21 112.14 0 top
R129  470Ω  [R0603]  114.21 109.61 0 top
R130  470Ω  [R0603]  114.21 107.1 0 top
R131  470Ω  [R0603]  114.21 104.52 0 top
R132  150Ω  [R0603]  114.21 101.98 0 top
R133  150Ω  [R0603]  114.21 99.44 0 top
R134  150Ω  [R0603]  114.21 96.91 0 top
R135  220Ω  [R0603]  114.21 94.36 0 top
R136  220Ω  [R0603]  114.21 91.82 0 top
R137  220Ω  [R0603]  142.21 114.68 0 top
R138  470Ω  [R0603]  142.21 112.14 0 top
R139  470Ω  [R0603]  142.21 109.61 0 top
R140  470Ω  [R0603]  142.21 107.1 0 top
R141  470Ω  [R0603]  142.21 104.52 0 top
R142  150Ω  [R0603]  142.21 101.98 0 top
R143  150Ω  [R0603]  142.21 99.44 0 top
R144  150Ω  [R0603]  142.21 96.91 0 top
R145  220Ω  [R0603]  142.21 94.36 0 top
R146  220Ω  [R0603]  142.21 91.82 0 top
R147  220Ω  [R0603]  153.77 99.82 0 top
R148  220Ω  [R0603]  153.77 97.32 0 top
R149  220Ω  [R0603]  153.77 94.82 0 top
R150  220Ω  [R0603]  153.77 92.32 0 top
R151  220Ω  [R0603]  153.77 89.82 0 top
U1  74HC165N  [DIP-16_L20.0-W6.4-P2.54-LS7.6-BL]  15.62 63.88 270 top
U2  74HC165N  [DIP-16_L20.0-W6.4-P2.54-LS7.6-BL]  43.56 64.52 270 top
U3  74HC165N  [DIP-16_L20.0-W6.4-P2.54-LS7.6-BL]  29.31 43.33 270 top
U4  74HC165N  [DIP-16_L20.0-W6.4-P2.54-LS7.6-BL]  57.53 42.67 270 top
U5  74HC165N  [DIP-16_L20.0-W6.4-P2.54-LS7.6-BL]  16 21.08 270 top
U6  74HC165N  [DIP-16_L20.0-W6.4-P2.54-LS7.6-BL]  44.07 21.21 270 top
U7  74HC165N  [DIP-16_L20.0-W6.4-P2.54-LS7.6-BL]  85.53 53.54 0 top
U8  74HC165N  [DIP-16_L20.0-W6.4-P2.54-LS7.6-BL]  85.02 25.35 0 top
U9  74HC595N  [DIP-16_L20.0-W6.4-P2.54-LS7.6-BL]  109.35 65.91 270 top
U10  74HC595N  [DIP-16_L20.0-W6.4-P2.54-LS7.6-BL]  127.08 65.91 270 top
U11  74HC595N  [DIP-16_L20.0-W6.4-P2.54-LS7.6-BL]  144.82 65.91 270 top
U12  74HC595N  [DIP-16_L20.0-W6.4-P2.54-LS7.6-BL]  162.56 65.91 270 top
U13  74HC595N  [DIP-16_L20.0-W6.4-P2.54-LS7.6-BL]  43.81 105.92 270 top
U14  74HC595N  [DIP-16_L20.0-W6.4-P2.54-LS7.6-BL]  67.56 105.92 270 top
U15  74HC595N  [DIP-16_L20.0-W6.4-P2.54-LS7.6-BL]  76.84 99.44 270 top
U16  74HC595N  [DIP-16_L20.0-W6.4-P2.54-LS7.6-BL]  95.63 105.92 270 top
U17  74HC595N  [DIP-16_L20.0-W6.4-P2.54-LS7.6-BL]  104.98 99.44 270 top
U18  74HC595N  [DIP-16_L20.0-W6.4-P2.54-LS7.6-BL]  123.82 105.92 270 top
U19  74HC595N  [DIP-16_L20.0-W6.4-P2.54-LS7.6-BL]  133.1 99.44 270 top

## Footprints (pads in the part's own frame, mm; a bottom-side part is the same pattern mirrored in y, then rotated)
DIP-16_L20.0-W6.4-P2.54-LS7.6-BL
  round 1.6 hole 1: 1(-8.89,-3.81) 2(-6.35,-3.81) 3(-3.81,-3.81) 4(-1.27,-3.81) 5(1.27,-3.81) 6(3.81,-3.81) 7(6.35,-3.81) 8(8.89,-3.81) 9(8.89,3.81) 10(6.35,3.81) 11(3.81,3.81) 12(1.27,3.81) 13(-1.27,3.81) 14(-3.81,3.81) 15(-6.35,3.81) 16(-8.89,3.81)
Pad_e56
  round 1.4 hole 0.8: 86(0,0)
Pad_e94
  round 1.4 hole 0.8: 1(0,0)
Pad_e96
  round 1.4 hole 0.8: 2(0,0)
Pad_e98
  round 1.4 hole 0.8: 3(0,0)
Pad_e100
  round 1.4 hole 0.8: 4(0,0)
Pad_e102
  round 1.4 hole 0.8: 5(0,0)
Pad_e144
  round 1.4 hole 0.8: 1(0,0)
Pad_e145
  round 1.4 hole 0.8: 2(0,0)
Pad_e146
  round 1.4 hole 0.8: 3(0,0)
Pad_e147
  round 1.4 hole 0.8: 4(0,0)
Pad_e148
  round 1.4 hole 0.8: 5(0,0)
Pad_e149
  round 1.4 hole 0.8: 6(0,0)
Pad_e150
  round 1.4 hole 0.8: 7(0,0)
Pad_e151
  round 1.4 hole 0.8: 8(0,0)
Pad_e152
  round 1.4 hole 0.8: 9(0,0)
Pad_e153
  round 1.4 hole 0.8: 10(0,0)
Pad_e154
  round 1.4 hole 0.8: 11(0,0)
Pad_e155
  round 1.4 hole 0.8: 12(0,0)
Pad_e156
  round 1.4 hole 0.8: 13(0,0)
Pad_e157
  round 1.4 hole 0.8: 14(0,0)
Pad_e158
  round 1.4 hole 0.8: 15(0,0)
Pad_e174
  round 1.4 hole 0.8: 16(0,0)
Pad_e175
  round 1.4 hole 0.8: 17(0,0)
Pad_e176
  round 1.4 hole 0.8: 18(0,0)
Pad_e177
  round 1.4 hole 0.8: 19(0,0)
Pad_e178
  round 1.4 hole 0.8: 20(0,0)
Pad_e179
  round 1.4 hole 0.8: 21(0,0)
Pad_e181
  round 1.4 hole 0.8: 22(0,0)
Pad_e182
  round 1.4 hole 0.8: 23(0,0)
Pad_e183
  round 1.4 hole 0.8: 24(0,0)
Pad_e184
  round 1.4 hole 0.8: 25(0,0)
Pad_e185
  round 1.4 hole 0.8: 26(0,0)
Pad_e186
  round 1.4 hole 0.8: 27(0,0)
Pad_e187
  round 1.4 hole 0.8: 28(0,0)
Pad_e7196
  round 1.4 hole 0.8: 86(0,0)
Pad_e7197
  round 1.4 hole 0.8: 87(0,0)
Pad_e7198
  round 1.4 hole 0.8: 88(0,0)
Pad_e7250
  round 1.2 hole 0.6: 29(0,0)
Pad_e7251
  round 1.2 hole 0.6: 30(0,0)
Pad_e7252
  round 1.2 hole 0.6: 31(0,0)
Pad_e7253
  round 1.2 hole 0.6: 32(0,0)
Pad_e7254
  round 1.2 hole 0.6: 33(0,0)
Pad_e7255
  round 1.2 hole 0.6: 34(0,0)
Pad_e7256
  round 1.2 hole 0.6: 35(0,0)
Pad_e7257
  round 1.2 hole 0.6: 36(0,0)
Pad_e7258
  round 1.2 hole 0.6: 37(0,0)
Pad_e7261
  round 1.2 hole 0.6: 38(0,0)
Pad_e7263
  round 1.2 hole 0.6: 29(0,0)
Pad_e7264
  round 1.2 hole 0.6: 30(0,0)
Pad_e7265
  round 1.2 hole 0.6: 31(0,0)
Pad_e7266
  round 1.2 hole 0.6: 32(0,0)
Pad_e7267
  round 1.2 hole 0.6: 33(0,0)
Pad_e7268
  round 1.2 hole 0.6: 34(0,0)
Pad_e7269
  round 1.2 hole 0.6: 35(0,0)
Pad_e7270
  round 1.2 hole 0.6: 36(0,0)
Pad_e7271
  round 1.2 hole 0.6: 37(0,0)
Pad_e7272
  round 1.2 hole 0.6: 38(0,0)
Pad_e7313
  round 4 hole 3.4: 1(0,0)
Pad_e7314
  round 4 hole 3.4: 1(0,0)
Pad_e7315
  round 1.2 hole 0.6: 33(0,0)
Pad_e7316
  round 1.2 hole 0.6: 34(0,0)
Pad_e7317
  round 1.2 hole 0.6: 35(0,0)
Pad_e7318
  round 1.2 hole 0.6: 36(0,0)
Pad_e7319
  round 1.2 hole 0.6: 37(0,0)
Pad_e7320
  round 1.2 hole 0.6: 38(0,0)
Pad_e7321
  round 1.2 hole 0.6: 35(0,0)
Pad_e7322
  round 1.2 hole 0.6: 36(0,0)
Pad_e7323
  round 1.2 hole 0.6: 37(0,0)
Pad_e7324
  round 1.2 hole 0.6: 38(0,0)
Pad_e7325
  round 1.2 hole 0.6: 33(0,0)
Pad_e7326
  round 1.2 hole 0.6: 34(0,0)
Pad_e7327
  round 1.2 hole 0.6: 35(0,0)
Pad_e7328
  round 1.2 hole 0.6: 36(0,0)
Pad_e7329
  round 1.2 hole 0.6: 37(0,0)
Pad_e7330
  round 1.2 hole 0.6: 38(0,0)
Pad_e7331
  round 1.2 hole 0.6: 35(0,0)
Pad_e7332
  round 1.2 hole 0.6: 36(0,0)
Pad_e7333
  round 1.2 hole 0.6: 37(0,0)
Pad_e7334
  round 1.2 hole 0.6: 38(0,0)
Pad_e7369
  round 1.2 hole 0.6: 33(0,0)
Pad_e7370
  round 1.2 hole 0.6: 34(0,0)
Pad_e7371
  round 1.2 hole 0.6: 35(0,0)
Pad_e7372
  round 1.2 hole 0.6: 36(0,0)
Pad_e7373
  round 1.2 hole 0.6: 31(0,0)
Pad_e7374
  round 1.2 hole 0.6: 32(0,0)
Pad_e7375
  round 1.2 hole 0.6: 29(0,0)
Pad_e7376
  round 1.2 hole 0.6: 30(0,0)
Pad_e7377
  round 1.2 hole 0.6: 33(0,0)
Pad_e7378
  round 1.2 hole 0.6: 34(0,0)
Pad_e7379
  round 1.2 hole 0.6: 37(0,0)
Pad_e7380
  round 1.2 hole 0.6: 38(0,0)
Pad_e7381
  round 1.2 hole 0.6: 36(0,0)
Pad_e7382
  round 1.2 hole 0.6: 37(0,0)
Pad_e7383
  round 1.2 hole 0.6: 35(0,0)
Pad_e7384
  round 1.2 hole 0.6: 37(0,0)
Pad_e7385
  round 1.2 hole 0.6: 38(0,0)
Pad_e7386
  round 1.2 hole 0.6: 35(0,0)
Pad_e7387
  round 1.2 hole 0.6: 36(0,0)
Pad_e7388
  round 1.2 hole 0.6: 38(0,0)
Pad_e7391
  round 1.2 hole 0.6: 33(0,0)
Pad_e7392
  round 1.2 hole 0.6: 34(0,0)
Pad_e7393
  round 1.2 hole 0.6: 35(0,0)
Pad_e7394
  round 1.2 hole 0.6: 36(0,0)
Pad_e7395
  round 1.2 hole 0.6: 31(0,0)
Pad_e7396
  round 1.2 hole 0.6: 32(0,0)
Pad_e7397
  round 1.2 hole 0.6: 29(0,0)
Pad_e7398
  round 1.2 hole 0.6: 30(0,0)
Pad_e7399
  round 1.2 hole 0.6: 33(0,0)
Pad_e7400
  round 1.2 hole 0.6: 34(0,0)
Pad_e7401
  round 1.2 hole 0.6: 37(0,0)
Pad_e7402
  round 1.2 hole 0.6: 38(0,0)
Pad_e7403
  round 1.2 hole 0.6: 36(0,0)
Pad_e7404
  round 1.2 hole 0.6: 37(0,0)
Pad_e7405
  round 1.2 hole 0.6: 35(0,0)
Pad_e7406
  round 1.2 hole 0.6: 37(0,0)
Pad_e7407
  round 1.2 hole 0.6: 38(0,0)
Pad_e7408
  round 1.2 hole 0.6: 35(0,0)
Pad_e7409
  round 1.2 hole 0.6: 36(0,0)
Pad_e7410
  round 1.2 hole 0.6: 38(0,0)
Pad_e7413
  round 1.2 hole 0.6: 33(0,0)
Pad_e7414
  round 1.2 hole 0.6: 34(0,0)
Pad_e7415
  round 1.2 hole 0.6: 35(0,0)
Pad_e7416
  round 1.2 hole 0.6: 36(0,0)
Pad_e7417
  round 1.2 hole 0.6: 31(0,0)
Pad_e7418
  round 1.2 hole 0.6: 32(0,0)
Pad_e7419
  round 1.2 hole 0.6: 29(0,0)
Pad_e7420
  round 1.2 hole 0.6: 30(0,0)
Pad_e7421
  round 1.2 hole 0.6: 33(0,0)
Pad_e7422
  round 1.2 hole 0.6: 34(0,0)
Pad_e7423
  round 1.2 hole 0.6: 37(0,0)
Pad_e7424
  round 1.2 hole 0.6: 38(0,0)
Pad_e7425
  round 1.2 hole 0.6: 36(0,0)
Pad_e7426
  round 1.2 hole 0.6: 37(0,0)
Pad_e7427
  round 1.2 hole 0.6: 35(0,0)
Pad_e7428
  round 1.2 hole 0.6: 37(0,0)
Pad_e7429
  round 1.2 hole 0.6: 38(0,0)
Pad_e7430
  round 1.2 hole 0.6: 35(0,0)
Pad_e7431
  round 1.2 hole 0.6: 36(0,0)
Pad_e7432
  round 1.2 hole 0.6: 38(0,0)
Pad_e7463
  round 1.4 hole 0.8: 88(0,0)
Pad_e7464
  round 1.4 hole 0.8: 87(0,0)
Pad_e7465
  round 1.4 hole 0.8: 86(0,0)
Pad_e7466
  round 1.4 hole 0.8: 5(0,0)
Pad_e7469
  round 1.4 hole 0.8: 4(0,0)
Pad_e8380
  round 6 hole 3.4: 1(0,0)
Pad_e8382
  round 6 hole 3.4: 1(0,0)
Pad_e8383
  round 6 hole 3.4: 1(0,0)
Pad_e8384
  round 6 hole 3.4: 1(0,0)
Pad_e9031
  round 1.4 hole 0.8: 1(0,0)
Pad_e9032
  round 1.4 hole 0.8: 2(0,0)
Pad_e9033
  round 1.4 hole 0.8: 3(0,0)
Pad_e9034
  round 1.4 hole 0.8: 4(0,0)
Pad_e9035
  round 1.4 hole 0.8: 5(0,0)
Pad_e9036
  round 1.4 hole 0.8: 6(0,0)
Pad_e9037
  round 1.4 hole 0.8: 7(0,0)
Pad_e9038
  round 1.4 hole 0.8: 8(0,0)
Pad_e9039
  round 1.4 hole 0.8: 9(0,0)
Pad_e9040
  round 1.4 hole 0.8: 10(0,0)
Pad_e9041
  round 1.4 hole 0.8: 11(0,0)
Pad_e9042
  round 1.4 hole 0.8: 12(0,0)
Pad_e9043
  round 1.4 hole 0.8: 13(0,0)
Pad_e9044
  round 1.4 hole 0.8: 14(0,0)
Pad_e9045
  round 1.4 hole 0.8: 15(0,0)
Pad_e9046
  round 1.4 hole 0.8: 16(0,0)
Pad_e9047
  round 1.4 hole 0.8: 17(0,0)
Pad_e9048
  round 1.4 hole 0.8: 18(0,0)
Pad_e9049
  round 1.4 hole 0.8: 19(0,0)
Pad_e9050
  round 1.4 hole 0.8: 20(0,0)
Pad_e9051
  round 1.4 hole 0.8: 21(0,0)
Pad_e9052
  round 1.4 hole 0.8: 22(0,0)
Pad_e9053
  round 1.4 hole 0.8: 23(0,0)
Pad_e9054
  round 1.4 hole 0.8: 24(0,0)
Pad_e9055
  round 1.4 hole 0.8: 25(0,0)
Pad_e9056
  round 1.4 hole 0.8: 26(0,0)
Pad_e9057
  round 1.4 hole 0.8: 27(0,0)
Pad_e9058
  round 1.4 hole 0.8: 28(0,0)
Pad_e9059
  round 1.4 hole 0.8: 29(0,0)
Pad_e9060
  round 1.4 hole 0.8: 30(0,0)
Pad_e9061
  round 1.4 hole 0.8: 31(0,0)
Pad_e9062
  round 1.4 hole 0.8: 32(0,0)
Pad_e9063
  round 1.4 hole 0.8: 33(0,0)
Pad_e9064
  round 1.4 hole 0.8: 34(0,0)
Pad_e9065
  round 1.4 hole 0.8: 35(0,0)
Pad_e9066
  round 1.4 hole 0.8: 36(0,0)
Pad_e9067
  round 1.4 hole 0.8: 37(0,0)
Pad_e9068
  round 1.4 hole 0.8: 38(0,0)
Pad_e9069
  round 1.4 hole 0.8: 39(0,0)
Pad_e9070
  round 1.4 hole 0.8: 40(0,0)
Pad_e9071
  round 1.4 hole 0.8: 41(0,0)
Pad_e9072
  round 1.4 hole 0.8: 42(0,0)
Pad_e9073
  round 1.4 hole 0.8: 43(0,0)
Pad_e9074
  round 1.4 hole 0.8: 44(0,0)
Pad_e9075
  round 1.4 hole 0.8: 45(0,0)
Pad_e9076
  round 1.4 hole 0.8: 46(0,0)
Pad_e9077
  round 1.4 hole 0.8: 47(0,0)
Pad_e9078
  round 1.4 hole 0.8: 48(0,0)
Pad_e9079
  round 1.4 hole 0.8: 49(0,0)
Pad_e9080
  round 1.4 hole 0.8: 50(0,0)
Pad_e9081
  round 1.4 hole 0.8: 51(0,0)
Pad_e9082
  round 1.4 hole 0.8: 52(0,0)
Pad_e9083
  round 1.4 hole 0.8: 53(0,0)
Pad_e9084
  round 1.4 hole 0.8: 54(0,0)
Pad_e9085
  round 1.4 hole 0.8: 55(0,0)
Pad_e9086
  round 1.4 hole 0.8: 56(0,0)
Pad_e9087
  round 1.4 hole 0.8: 57(0,0)
Pad_e9088
  round 1.4 hole 0.8: 58(0,0)
Pad_e9089
  round 1.4 hole 0.8: 59(0,0)
Pad_e9090
  round 1.4 hole 0.8: 60(0,0)
Pad_e9091
  round 1.4 hole 0.8: 61(0,0)
Pad_e9092
  round 1.4 hole 0.8: 62(0,0)
Pad_e9093
  round 1.4 hole 0.8: 63(0,0)
Pad_e9094
  round 1.4 hole 0.8: 64(0,0)
Pad_e9503
  round 1.2 hole 0.6: 1(0,0)
Pad_e9504
  round 1.2 hole 0.6: 2(0,0)
Pad_e9505
  round 1.2 hole 0.6: 3(0,0)
Pad_e9506
  round 1.2 hole 0.6: 4(0,0)
Pad_e9507
  round 1.2 hole 0.6: 5(0,0)
Pad_e9508
  round 1.2 hole 0.6: 6(0,0)
Pad_e9509
  round 1.2 hole 0.6: 7(0,0)
Pad_e9510
  round 1.2 hole 0.6: 8(0,0)
Pad_e9511
  round 1.2 hole 0.6: 9(0,0)
Pad_e9512
  round 1.2 hole 0.6: 10(0,0)
Pad_e10897
  round 1.4 hole 0.8: 65(0,0)
Pad_e10898
  round 1.4 hole 0.8: 66(0,0)
Pad_e10899
  round 1.4 hole 0.8: 67(0,0)
Pad_e10900
  round 1.4 hole 0.8: 68(0,0)
Pad_e10901
  round 1.4 hole 0.8: 69(0,0)
Pad_e10902
  round 1.4 hole 0.8: 70(0,0)
Pad_e10903
  round 1.4 hole 0.8: 71(0,0)
Pad_e10904
  round 1.4 hole 0.8: 72(0,0)
Pad_e10905
  round 1.4 hole 0.8: 73(0,0)
Pad_e10906
  round 1.4 hole 0.8: 74(0,0)
Pad_e10907
  round 1.4 hole 0.8: 75(0,0)
Pad_e10908
  round 1.4 hole 0.8: 76(0,0)
Pad_e10909
  round 1.4 hole 0.8: 77(0,0)
Pad_e10910
  round 1.4 hole 0.8: 78(0,0)
Pad_e10911
  round 1.4 hole 0.8: 79(0,0)
Pad_e10912
  round 1.4 hole 0.8: 80(0,0)
Pad_e10913
  round 1.4 hole 0.8: 81(0,0)
Pad_e10914
  round 1.4 hole 0.8: 82(0,0)
Pad_e10915
  round 1.4 hole 0.8: 83(0,0)
Pad_e10916
  round 1.4 hole 0.8: 84(0,0)
Pad_e10917
  round 1.4 hole 0.8: 85(0,0)
Pad_e10918
  round 1.4 hole 0.8: 88(0,0)
Pad_e10919
  round 1.4 hole 0.8: 89(0,0)
Pad_e10920
  round 1.4 hole 0.8: 90(0,0)
Pad_e10921
  round 1.4 hole 0.8: 91(0,0)
Pad_e10922
  round 1.4 hole 0.8: 92(0,0)
Pad_e10923
  round 1.4 hole 0.8: 93(0,0)
Pad_e10924
  round 1.4 hole 0.8: 94(0,0)
Pad_e10925
  round 1.4 hole 0.8: 95(0,0)
Pad_e10926
  round 1.4 hole 0.8: 96(0,0)
Pad_e10927
  round 1.4 hole 0.8: 97(0,0)
Pad_e10928
  round 1.4 hole 0.8: 98(0,0)
Pad_e10929
  round 1.4 hole 0.8: 99(0,0)
Pad_e10930
  round 1.4 hole 0.8: 100(0,0)
Pad_e10931
  round 1.4 hole 0.8: 101(0,0)
Pad_e10932
  round 1.4 hole 0.8: 102(0,0)
Pad_e10933
  round 1.4 hole 0.8: 103(0,0)
Pad_e10934
  round 1.4 hole 0.8: 104(0,0)
Pad_e10935
  round 1.4 hole 0.8: 105(0,0)
Pad_e10936
  round 1.4 hole 0.8: 106(0,0)
Pad_e10937
  round 1.4 hole 0.8: 107(0,0)
Pad_e10938
  round 1.4 hole 0.8: 108(0,0)
Pad_e10939
  round 1.4 hole 0.8: 109(0,0)
Pad_e10940
  round 1.4 hole 0.8: 110(0,0)
Pad_e10941
  round 1.4 hole 0.8: 111(0,0)
Pad_e10942
  round 1.4 hole 0.8: 112(0,0)
Pad_e10943
  round 1.4 hole 0.8: 113(0,0)
Pad_e10944
  round 1.4 hole 0.8: 114(0,0)
Pad_e10945
  round 1.4 hole 0.8: 115(0,0)
Pad_e10946
  round 1.4 hole 0.8: 116(0,0)
Pad_e10947
  round 1.4 hole 0.8: 117(0,0)
Pad_e10948
  round 1.4 hole 0.8: 118(0,0)
Pad_e10949
  round 1.4 hole 0.8: 119(0,0)
Pad_e10950
  round 1.4 hole 0.8: 120(0,0)
Pad_e10951
  round 1.4 hole 0.8: 121(0,0)
Pad_e10952
  round 1.4 hole 0.8: 122(0,0)
Pad_e10953
  round 1.4 hole 0.8: 123(0,0)
Pad_e10954
  round 1.4 hole 0.8: 124(0,0)
Pad_e10955
  round 1.4 hole 0.8: 125(0,0)
Pad_e10956
  round 1.4 hole 0.8: 126(0,0)
Pad_e10957
  round 1.4 hole 0.8: 127(0,0)
Pad_e10958
  round 1.4 hole 0.8: 128(0,0)
Pad_e10959
  round 1.4 hole 0.8: 129(0,0)
Pad_e10960
  round 1.4 hole 0.8: 130(0,0)
Pad_e10961
  round 1.4 hole 0.8: 131(0,0)
Pad_e10962
  round 1.4 hole 0.8: 132(0,0)
Pad_e10963
  round 1.4 hole 0.8: 133(0,0)
Pad_e10964
  round 1.4 hole 0.8: 134(0,0)
Pad_e10965
  round 1.4 hole 0.8: 135(0,0)
Pad_e10966
  round 1.4 hole 0.8: 136(0,0)
Pad_e10967
  round 1.4 hole 0.8: 137(0,0)
Pad_e10968
  round 1.4 hole 0.8: 138(0,0)
Pad_e10969
  round 1.4 hole 0.8: 139(0,0)
Pad_e10970
  round 1.4 hole 0.8: 140(0,0)
Pad_e10971
  round 1.4 hole 0.8: 141(0,0)
Pad_e10972
  round 1.4 hole 0.8: 142(0,0)
Pad_e10973
  round 1.4 hole 0.8: 143(0,0)
Pad_e10974
  round 1.4 hole 0.8: 144(0,0)
Pad_e10975
  round 1.4 hole 0.8: 145(0,0)
Pad_e10976
  round 1.4 hole 0.8: 146(0,0)
Pad_e10977
  round 1.4 hole 0.8: 147(0,0)
Pad_e10978
  round 1.4 hole 0.8: 148(0,0)
Pad_e10979
  round 1.4 hole 0.8: 149(0,0)
Pad_e10980
  round 1.4 hole 0.8: 150(0,0)
Pad_e10981
  round 1.4 hole 0.8: 151(0,0)
Pad_e10982
  round 1.4 hole 0.8: 152(0,0)
Pad_e10983
  round 1.4 hole 0.8: 153(0,0)
Pad_e10984
  round 1.4 hole 0.8: 154(0,0)
Pad_e10985
  round 1.4 hole 0.8: 155(0,0)
Pad_e10986
  round 1.4 hole 0.8: 156(0,0)
Pad_e10987
  round 1.4 hole 0.8: 157(0,0)
Pad_e10988
  round 1.4 hole 0.8: 158(0,0)
Pad_e10989
  round 1.4 hole 0.8: 159(0,0)
Pad_e10990
  round 1.4 hole 0.8: 160(0,0)
Pad_e10991
  round 1.4 hole 0.8: 161(0,0)
Pad_e10992
  round 1.4 hole 0.8: 162(0,0)
Pad_e10993
  round 1.4 hole 0.8: 163(0,0)
Pad_e10994
  round 1.4 hole 0.8: 164(0,0)
Pad_e10995
  round 1.4 hole 0.8: 165(0,0)
Pad_e10996
  round 1.4 hole 0.8: 166(0,0)
Pad_e10997
  round 1.4 hole 0.8: 167(0,0)
Pad_e10998
  round 1.4 hole 0.8: 168(0,0)
Pad_e10999
  round 1.4 hole 0.8: 169(0,0)
Pad_e11000
  round 1.4 hole 0.8: 170(0,0)
Pad_e11001
  round 1.4 hole 0.8: 171(0,0)
Pad_e11002
  round 1.4 hole 0.8: 172(0,0)
Pad_e11003
  round 1.4 hole 0.8: 173(0,0)
Pad_e11004
  round 1.4 hole 0.8: 174(0,0)
Pad_e11005
  round 1.4 hole 0.8: 175(0,0)
Pad_e11006
  round 1.4 hole 0.8: 176(0,0)
Pad_e11007
  round 1.4 hole 0.8: 177(0,0)
Pad_e11008
  round 1.4 hole 0.8: 178(0,0)
Pad_e11009
  round 1.4 hole 0.8: 179(0,0)
Pad_e11010
  round 1.4 hole 0.8: 180(0,0)
Pad_e11011
  round 1.4 hole 0.8: 181(0,0)
Pad_e11012
  round 1.4 hole 0.8: 182(0,0)
Pad_e11013
  round 1.4 hole 0.8: 183(0,0)
Pad_e11014
  round 1.4 hole 0.8: 184(0,0)
Pad_e11015
  round 1.4 hole 0.8: 185(0,0)
Pad_e11016
  round 1.4 hole 0.8: 186(0,0)
Pad_e11017
  round 1.4 hole 0.8: 187(0,0)
Pad_e11018
  round 1.4 hole 0.8: 188(0,0)
Pad_e11019
  round 1.4 hole 0.8: 189(0,0)
Pad_e11020
  round 1.4 hole 0.8: 190(0,0)
Pad_e11021
  round 1.4 hole 0.8: 191(0,0)
Pad_e11022
  round 1.4 hole 0.8: 192(0,0)
Pad_e11025
  round 1.4 hole 0.8: 193(0,0)
Pad_e11026
  round 1.4 hole 0.8: 194(0,0)
Pad_e16675
  round 1.4 hole 0.8: 5(0,0)
Pad_e16676
  round 1.4 hole 0.8: 4(0,0)
Pad_e16677
  round 1.4 hole 0.8: 5(0,0)
Pad_e16678
  round 1.4 hole 0.8: 4(0,0)
R0603
  rect 0.806x0.864 smd: 1(-0.753,0) 2(0.753,0)
RES-TH_BD2.7-L6.2-P10.20-D0.4
  round 1.4 hole 0.8: 1(-5.1,0) 2(5.1,0)

## Nets
GND: NOREF#32.8 NOREF#50.20 NOREF#71.11 NOREF#98.5 NOREF#124.14 NOREF#151.5 NOREF#176.2 NOREF#218.17 NOREF#259.5 NOREF#334.5 R1.2 R2.2 R3.2 R4.2 R5.2 R6.2 R7.2 R8.2 R9.2 R10.2 R11.2 R12.2 R13.2 R14.2 R15.2 R16.2 R17.2 R18.2 R19.2 R20.2 R21.2 R22.2 R23.2 R24.2 R25.2 R26.2 R27.2 R28.2 R29.2 R30.2 R31.2 R32.2 R33.2 R34.2 R35.2 R36.2 R37.2 R38.2 R39.2 R40.2 R41.2 R42.2 R43.2 R44.2 R45.2 R46.2 R47.2 R48.2 R49.2 R50.2 R51.2 R52.2 R53.2 R54.2 R55.2 R56.2 R57.2 R58.2 R59.2 R60.2 R61.2 R62.2 R63.2 R64.2 R65.2 R66.2 R67.2 R68.2 R69.2 R70.2 R71.2 R72.2 R73.2 R74.2 R75.2 R76.2 R77.2 R78.2 R79.2 R80.2 R81.2 R82.2 R83.2 R84.2 R85.2 R86.2 R87.2 R88.2 R89.2 R90.2 R91.2 R92.2 R93.2 R94.2 R95.2 R96.2 U1.8 U2.8 U3.8 U4.8 U5.8 U6.8 U7.8 U8.8 U9.8 U9.13 U10.8 U10.13 U11.8 U11.13 U12.8 U12.13
GND2: NOREF#332.5 R97.2 R98.2 R99.2 R100.2 R101.2 R102.2 R103.2 R104.2 R105.2 R106.2 R107.2 R108.2 R109.2 R110.2 R111.2 R112.2 R113.2 R114.2 R115.2 R116.2 R117.2 R118.2 R119.2 R120.2 R121.2 R122.2 R123.2 R124.2 R125.2 R126.2 R127.2 R128.2 R129.2 R130.2 R131.2 R132.2 R133.2 R134.2 R135.2 R136.2 R137.2 R138.2 R139.2 R140.2 R141.2 R142.2 R143.2 R144.2 R145.2 R146.2 R147.2 R148.2 R149.2 R150.2 R151.2 U13.8 U13.13 U14.8 U14.13 U15.8 U15.13 U16.8 U16.13 U17.8 U17.13 U18.8 U18.13 U19.8 U19.13
VCC: NOREF#2.95 NOREF#6.117 NOREF#21.67 NOREF#22.133 NOREF#23.16 NOREF#24.4 NOREF#29.145 NOREF#41.165 NOREF#46.91 NOREF#49.129 NOREF#57.163 NOREF#67.181 NOREF#82.1 NOREF#84.159 NOREF#85.141 NOREF#86.169 NOREF#93.79 NOREF#100.131 NOREF#101.173 NOREF#104.73 NOREF#105.143 NOREF#113.85 NOREF#117.4 NOREF#118.119 NOREF#122.147 NOREF#127.177 NOREF#128.4 NOREF#129.153 NOREF#134.191 NOREF#136.135 NOREF#143.71 NOREF#144.175 NOREF#158.183 NOREF#169.167 NOREF#170.161 NOREF#177.123 NOREF#178.113 NOREF#183.103 NOREF#188.121 NOREF#190.77 NOREF#193.107 NOREF#194.139 NOREF#195.75 NOREF#197.99 NOREF#200.101 NOREF#207.185 NOREF#214.151 NOREF#216.4 NOREF#219.193 NOREF#222.19 NOREF#228.81 NOREF#229.189 NOREF#230.7 NOREF#235.179 NOREF#245.105 NOREF#256.127 NOREF#260.97 NOREF#261.125 NOREF#271.137 NOREF#280.83 NOREF#284.157 NOREF#285.149 NOREF#291.109 NOREF#296.10 NOREF#304.171 NOREF#316.89 NOREF#319.155 NOREF#324.93 NOREF#326.115 NOREF#336.111 NOREF#345.187 NOREF#347.69 NOREF#348.65 NOREF#352.13 U1.16 U2.16 U3.16 U4.16 U5.16 U6.16 U7.16 U8.16 U9.10 U9.16 U10.10 U10.16 U11.10 U11.16 U12.10 U12.16
VCC2: NOREF#238.4 U13.10 U13.16 U14.10 U14.16 U15.10 U15.16 U16.10 U16.16 U17.10 U17.16 U18.10 U18.16 U19.10 U19.16
$R1_1: NOREF#16.2 R1.1
$R2_1: NOREF#254.4 R2.1
$R3_1: NOREF#154.6 R3.1
$R4_1: NOREF#13.8 R4.1
$R5_1: NOREF#224.10 R5.1
$R6_1: NOREF#53.12 R6.1
$R7_1: NOREF#306.14 R7.1
$R8_1: NOREF#295.16 R8.1
$R9_1: NOREF#35.18 R9.1
$R10_1: NOREF#4.20 R10.1
$R11_1: NOREF#350.22 R11.1
$R12_1: NOREF#139.24 R12.1
$R13_1: NOREF#140.26 R13.1
$R14_1: NOREF#298.28 R14.1
$R15_1: NOREF#234.30 R15.1
$R16_1: NOREF#12.32 R16.1
$R17_1: NOREF#91.34 R17.1
$R18_1: NOREF#217.36 R18.1
$R19_1: NOREF#108.38 R19.1
$R20_1: NOREF#242.40 R20.1
$R21_1: NOREF#233.42 R21.1
$R22_1: NOREF#126.44 R22.1
$R23_1: NOREF#290.46 R23.1
$R24_1: NOREF#76.48 R24.1
$R25_1: NOREF#309.50 R25.1
$R26_1: NOREF#299.52 R26.1
$R27_1: NOREF#155.54 R27.1
$R28_1: NOREF#111.56 R28.1
$R29_1: NOREF#38.58 R29.1
$R30_1: NOREF#179.60 R30.1
$R31_1: NOREF#137.62 R31.1
$R32_1: NOREF#88.64 R32.1
$R97_1: NOREF#337.29 R97.1
$R98_1: NOREF#344.31 R98.1
$R99_1: NOREF#66.33 R99.1
$R100_1: NOREF#109.35 R100.1
$R101_1: NOREF#146.37 R101.1
$R102_1: NOREF#275.33 R102.1
$R103_1: NOREF#323.35 R103.1
$R104_1: NOREF#196.37 R104.1
$R105_1: NOREF#40.35 R105.1
$R106_1: NOREF#308.37 R106.1
$R107_1: NOREF#237.29 R107.1
$R108_1: NOREF#240.31 R108.1
$R109_1: NOREF#171.33 R109.1
$R110_1: NOREF#83.35 R110.1
$R111_1: NOREF#286.37 R111.1
$R112_1: NOREF#318.33 R112.1
$R113_1: NOREF#168.35 R113.1
$R114_1: NOREF#181.37 R114.1
$R115_1: NOREF#26.35 R115.1
$R116_1: NOREF#80.37 R116.1
$R117_1: NOREF#282.29 R117.1
$R118_1: NOREF#182.31 R118.1
$R119_1: NOREF#274.33 R119.1
$R120_1: NOREF#307.35 R120.1
$R121_1: NOREF#320.37 R121.1
$R122_1: NOREF#3.33 R122.1
$R123_1: NOREF#263.35 R123.1
$R124_1: NOREF#273.37 R124.1
$R125_1: NOREF#314.35 R125.1
$R126_1: NOREF#293.37 R126.1
$R127_1: NOREF#208.29 R127.1
$R128_1: NOREF#270.31 R128.1
$R129_1: NOREF#116.33 R129.1
$R130_1: NOREF#59.35 R130.1
$R131_1: NOREF#36.37 R131.1
$R132_1: NOREF#264.33 R132.1
$R133_1: NOREF#353.35 R133.1
$R134_1: NOREF#142.37 R134.1
$R135_1: NOREF#9.35 R135.1
$R136_1: NOREF#277.37 R136.1
$R137_1: NOREF#227.29 R137.1
$R138_1: NOREF#187.31 R138.1
$R139_1: NOREF#220.33 R139.1
$R140_1: NOREF#203.35 R140.1
$R141_1: NOREF#213.37 R141.1
$R142_1: NOREF#94.33 R142.1
$R143_1: NOREF#312.35 R143.1
$R144_1: NOREF#321.37 R144.1
$R145_1: NOREF#258.35 R145.1
$R146_1: NOREF#185.37 R146.1
$R147_1: NOREF#132.2 R147.1
$R148_1: NOREF#276.4 R148.1
$R149_1: NOREF#340.6 R149.1
$R150_1: NOREF#62.8 R150.1
$R151_1: NOREF#215.10 R151.1
$U13_1: NOREF#313.32 U13.1
$U13_2: NOREF#133.34 U13.2
$U13_3: NOREF#58.36 U13.3
$U13_4: NOREF#255.38 U13.4
$U13_5: NOREF#335.34 U13.5
$U13_6: NOREF#28.36 U13.6
$U13_7: NOREF#297.38 U13.7
$U13_9: U13.9 U14.14
$U13_15: NOREF#110.30 U13.15
$U14_1: NOREF#223.38 U14.1
$U14_2: NOREF#147.30 U14.2
$U14_3: NOREF#341.32 U14.3
$U14_4: NOREF#60.34 U14.4
$U14_5: NOREF#114.36 U14.5
$U14_6: NOREF#265.38 U14.6
$U14_7: NOREF#173.34 U14.7
$U14_9: U14.9 U15.14
$U14_15: NOREF#69.36 U14.15
$U15_1: NOREF#90.38 U15.1
$U15_2: NOREF#225.36 U15.2
$U15_3: NOREF#249.38 U15.3
$U15_4: NOREF#283.30 U15.4
$U15_5: NOREF#54.32 U15.5
$U15_6: NOREF#253.34 U15.6
$U15_7: NOREF#56.36 U15.7
$U15_9: U15.9 U16.14
$U15_15: NOREF#199.36 U15.15
$U16_1: NOREF#95.34 U16.1
$U16_2: NOREF#51.36 U16.2
$U16_3: NOREF#160.38 U16.3
$U16_4: NOREF#164.36 U16.4
$U16_5: NOREF#252.38 U16.5
$U16_6: NOREF#64.30 U16.6
$U16_7: NOREF#17.32 U16.7
$U16_9: U16.9 U17.14
$U16_15: NOREF#123.38 U16.15
$U17_1: NOREF#303.36 U17.1
$U17_2: NOREF#89.38 U17.2
$U17_3: NOREF#343.34 U17.3
$U17_4: NOREF#346.36 U17.4
$U17_5: NOREF#157.38 U17.5
$U17_6: NOREF#205.36 U17.6
$U17_7: NOREF#278.38 U17.7
$U17_9: U17.9 U18.14
$U17_15: NOREF#301.34 U17.15
$U18_1: NOREF#5.32 U18.1
$U18_2: NOREF#37.34 U18.2
$U18_3: NOREF#77.36 U18.3
$U18_4: NOREF#210.38 U18.4
$U18_5: NOREF#317.34 U18.5
$U18_6: NOREF#92.36 U18.6
$U18_7: NOREF#247.38 U18.7
$U18_9: U18.9 U19.14
$U18_15: NOREF#166.30 U18.15
$U19_1: NOREF#251.38 U19.1
$U19_2: NOREF#204.1 U19.2
$U19_3: NOREF#162.3 U19.3
$U19_4: NOREF#106.5 U19.4
$U19_5: NOREF#48.7 U19.5
$U19_6: NOREF#156.9 U19.6
$U19_15: NOREF#338.36 U19.15
CLK: NOREF#150.87 U9.11 U10.11 U11.11 U12.11
CLK2: NOREF#330.87 U13.11 U14.11 U15.11 U16.11 U17.11 U18.11 U19.11
CLOCK: NOREF#11.1 U1.2 U2.2 U3.2 U4.2 U5.2 U6.2 U7.2 U8.2
ENABLE: NOREF#47.2 U1.15 U2.15 U3.15 U4.15 U5.15 U6.15 U7.15 U8.15
IN: NOREF#145.86 U9.14
IN2: NOREF#96.86 U13.14
LATCH: NOREF#70.3 U1.1 U2.1 U3.1 U4.1 U5.1 U6.1 U7.1 U8.1
LED0: NOREF#315.1 U9.15
LED1: NOREF#250.3 U9.1
LED2: NOREF#236.5 U9.2
LED3: NOREF#44.7 U9.3
LED4: NOREF#39.9 U9.4
LED5: NOREF#107.11 U9.5
LED6: NOREF#61.13 U9.6
LED7: NOREF#211.15 U9.7
LED8: NOREF#311.17 U10.15
LED9: NOREF#115.19 U10.1
LED10: NOREF#329.21 U10.2
LED11: NOREF#206.23 U10.3
LED12: NOREF#63.25 U10.4
LED13: NOREF#81.27 U10.5
LED14: NOREF#74.29 U10.6
LED15: NOREF#52.31 U10.7
LED16: NOREF#8.33 U11.15
LED17: NOREF#327.35 U11.1
LED18: NOREF#161.37 U11.2
LED19: NOREF#209.39 U11.3
LED20: NOREF#130.41 U11.4
LED21: NOREF#294.43 U11.5
LED22: NOREF#15.45 U11.6
LED23: NOREF#184.47 U11.7
LED24: NOREF#333.49 U12.15
LED25: NOREF#65.51 U12.1
LED26: NOREF#267.53 U12.2
LED27: NOREF#131.55 U12.3
LED28: NOREF#99.57 U12.4
LED29: NOREF#45.59 U12.5
LED30: NOREF#167.61 U12.6
LED31: NOREF#302.63 U12.7
LTCH: NOREF#310.88 U9.12 U10.12 U11.12 U12.12
LTCH2: NOREF#248.88 U13.12 U14.12 U15.12 U16.12 U17.12 U18.12 U19.12
NET2: NOREF#272.66 R33.1 U1.11
NET3: NOREF#342.74 R34.1 U1.12
NET4: NOREF#31.82 R35.1 U1.13
NET5: NOREF#305.92 R36.1 U1.14
NET6: NOREF#198.100 R37.1 U1.3
NET7: NOREF#20.108 R38.1 U1.4
NET8: NOREF#212.116 R39.1 U1.5
NET9: NOREF#138.124 R40.1 U1.6
NET10: NOREF#125.132 R41.1 U2.11
NET11: NOREF#149.140 R42.1 U2.12
NET12: NOREF#102.148 R43.1 U2.13
NET13: NOREF#152.156 R44.1 U2.14
NET14: NOREF#300.164 R45.1 U2.3
NET15: NOREF#42.172 R46.1 U2.4
NET16: NOREF#191.180 R47.1 U2.5
NET17: NOREF#266.188 R48.1 U2.6
NET18: NOREF#141.68 R49.1 U3.11
NET19: NOREF#112.76 R50.1 U3.12
NET20: NOREF#279.84 R51.1 U3.13
NET21: NOREF#55.94 R52.1 U3.14
NET22: NOREF#73.102 R53.1 U3.3
NET23: NOREF#153.110 R54.1 U3.4
NET24: NOREF#354.118 R55.1 U3.5
NET25: NOREF#257.126 R56.1 U3.6
NET26: NOREF#135.134 R57.1 U4.11
NET27: NOREF#281.142 R58.1 U4.12
NET28: NOREF#33.150 R59.1 U4.13
NET29: NOREF#72.158 R60.1 U4.14
NET30: NOREF#351.166 R61.1 U4.3
NET31: NOREF#269.174 R62.1 U4.4
NET32: NOREF#325.182 R63.1 U4.5
NET33: NOREF.190 R64.1 U4.6
NET34: NOREF#19.70 R65.1 U5.11
NET35: NOREF#103.78 R66.1 U5.12
NET36: NOREF#75.88 R67.1 U5.13
NET37: NOREF#97.96 R68.1 U5.14
NET38: NOREF#243.104 R69.1 U5.3
NET39: NOREF#262.112 R70.1 U5.4
NET40: NOREF#165.120 R71.1 U5.5
NET41: NOREF#27.128 R72.1 U5.6
NET42: NOREF#331.136 R73.1 U6.11
NET43: NOREF#172.144 R74.1 U6.12
NET44: NOREF#289.152 R75.1 U6.13
NET45: NOREF#18.160 R76.1 U6.14
NET46: NOREF#10.168 R77.1 U6.3
NET47: NOREF#292.176 R78.1 U6.4
NET48: NOREF#148.184 R79.1 U6.5
NET49: NOREF#241.192 R80.1 U6.6
NET50: NOREF#239.72 R81.1 U7.11
NET51: NOREF#201.80 R82.1 U7.12
NET52: NOREF#174.90 R83.1 U7.13
NET53: NOREF#328.98 R84.1 U7.14
NET54: NOREF#43.106 R85.1 U7.3
NET55: NOREF#7.114 R86.1 U7.4
NET56: NOREF#79.122 R87.1 U7.5
NET57: NOREF#180.130 R88.1 U7.6
NET58: NOREF#186.138 R89.1 U8.11
NET59: NOREF#268.146 R90.1 U8.12
NET60: NOREF#120.154 R91.1 U8.13
NET61: NOREF#163.162 R92.1 U8.14
NET62: NOREF#349.170 R93.1 U8.3
NET63: NOREF#246.178 R94.1 U8.4
NET64: NOREF#175.186 R95.1 U8.5
NET65: NOREF#68.194 R96.1 U8.6
OUT: NOREF#221.86 U8.9
THR: NOREF#25.28 NOREF#159.21
XL: NOREF#78.22 NOREF#287.3
XR: NOREF#121.25 NOREF#231.12
YL: NOREF#14.6 NOREF#288.23
YR: NOREF#226.15 NOREF#339.26
ZL: NOREF#34.24 NOREF#192.9
ZR: NOREF#119.18 NOREF#244.27
$1N2794: U1.9 U2.10
$1N2813: U2.9 U3.10
$1N2832: U3.9 U4.10
$1N2851: U4.9 U5.10
$1N2871: U5.9 U6.10
$1N2890: U6.9 U7.10
$1N2909: U7.9 U8.10
$1N5175: U10.9 U11.14
$1N5215: U11.9 U12.14
$1N10708: U9.9 U10.14

Pads without a net: NOREF#30 1; NOREF#87 1; NOREF#189 1; NOREF#202 1; NOREF#232 1; NOREF#322 1; U1 7 10; U2 7; U3 7; U4 7; U5 7; U6 7; U7 7; U8 7; U12 9; U19 7 9

## Via types
v1: diameter 0.61, hole 0.305, Top Layer to Bottom Layer, 93 vias
